# EasyEDA Pro project RV1106_V1.epro, schematic Schematic1

## Sheets
1 POWER: Assembly Variant: Basic; Board Name: Board1; Create Date: 2026-03-10; Page Name: P1; Project Name: rv1106g3-dev-board; Schematic Name: Schematic1; Update Date: 2026-03-10; BladeWidth: 10; Company: 嘉立创EDA; Page Size: A4; RegionStart: 1; ShowBorder: 1; TitleBlock: 1; TitleBlockPosition: 3; Version: V1.0; XRegionCount: 6; YRegionCount: 4
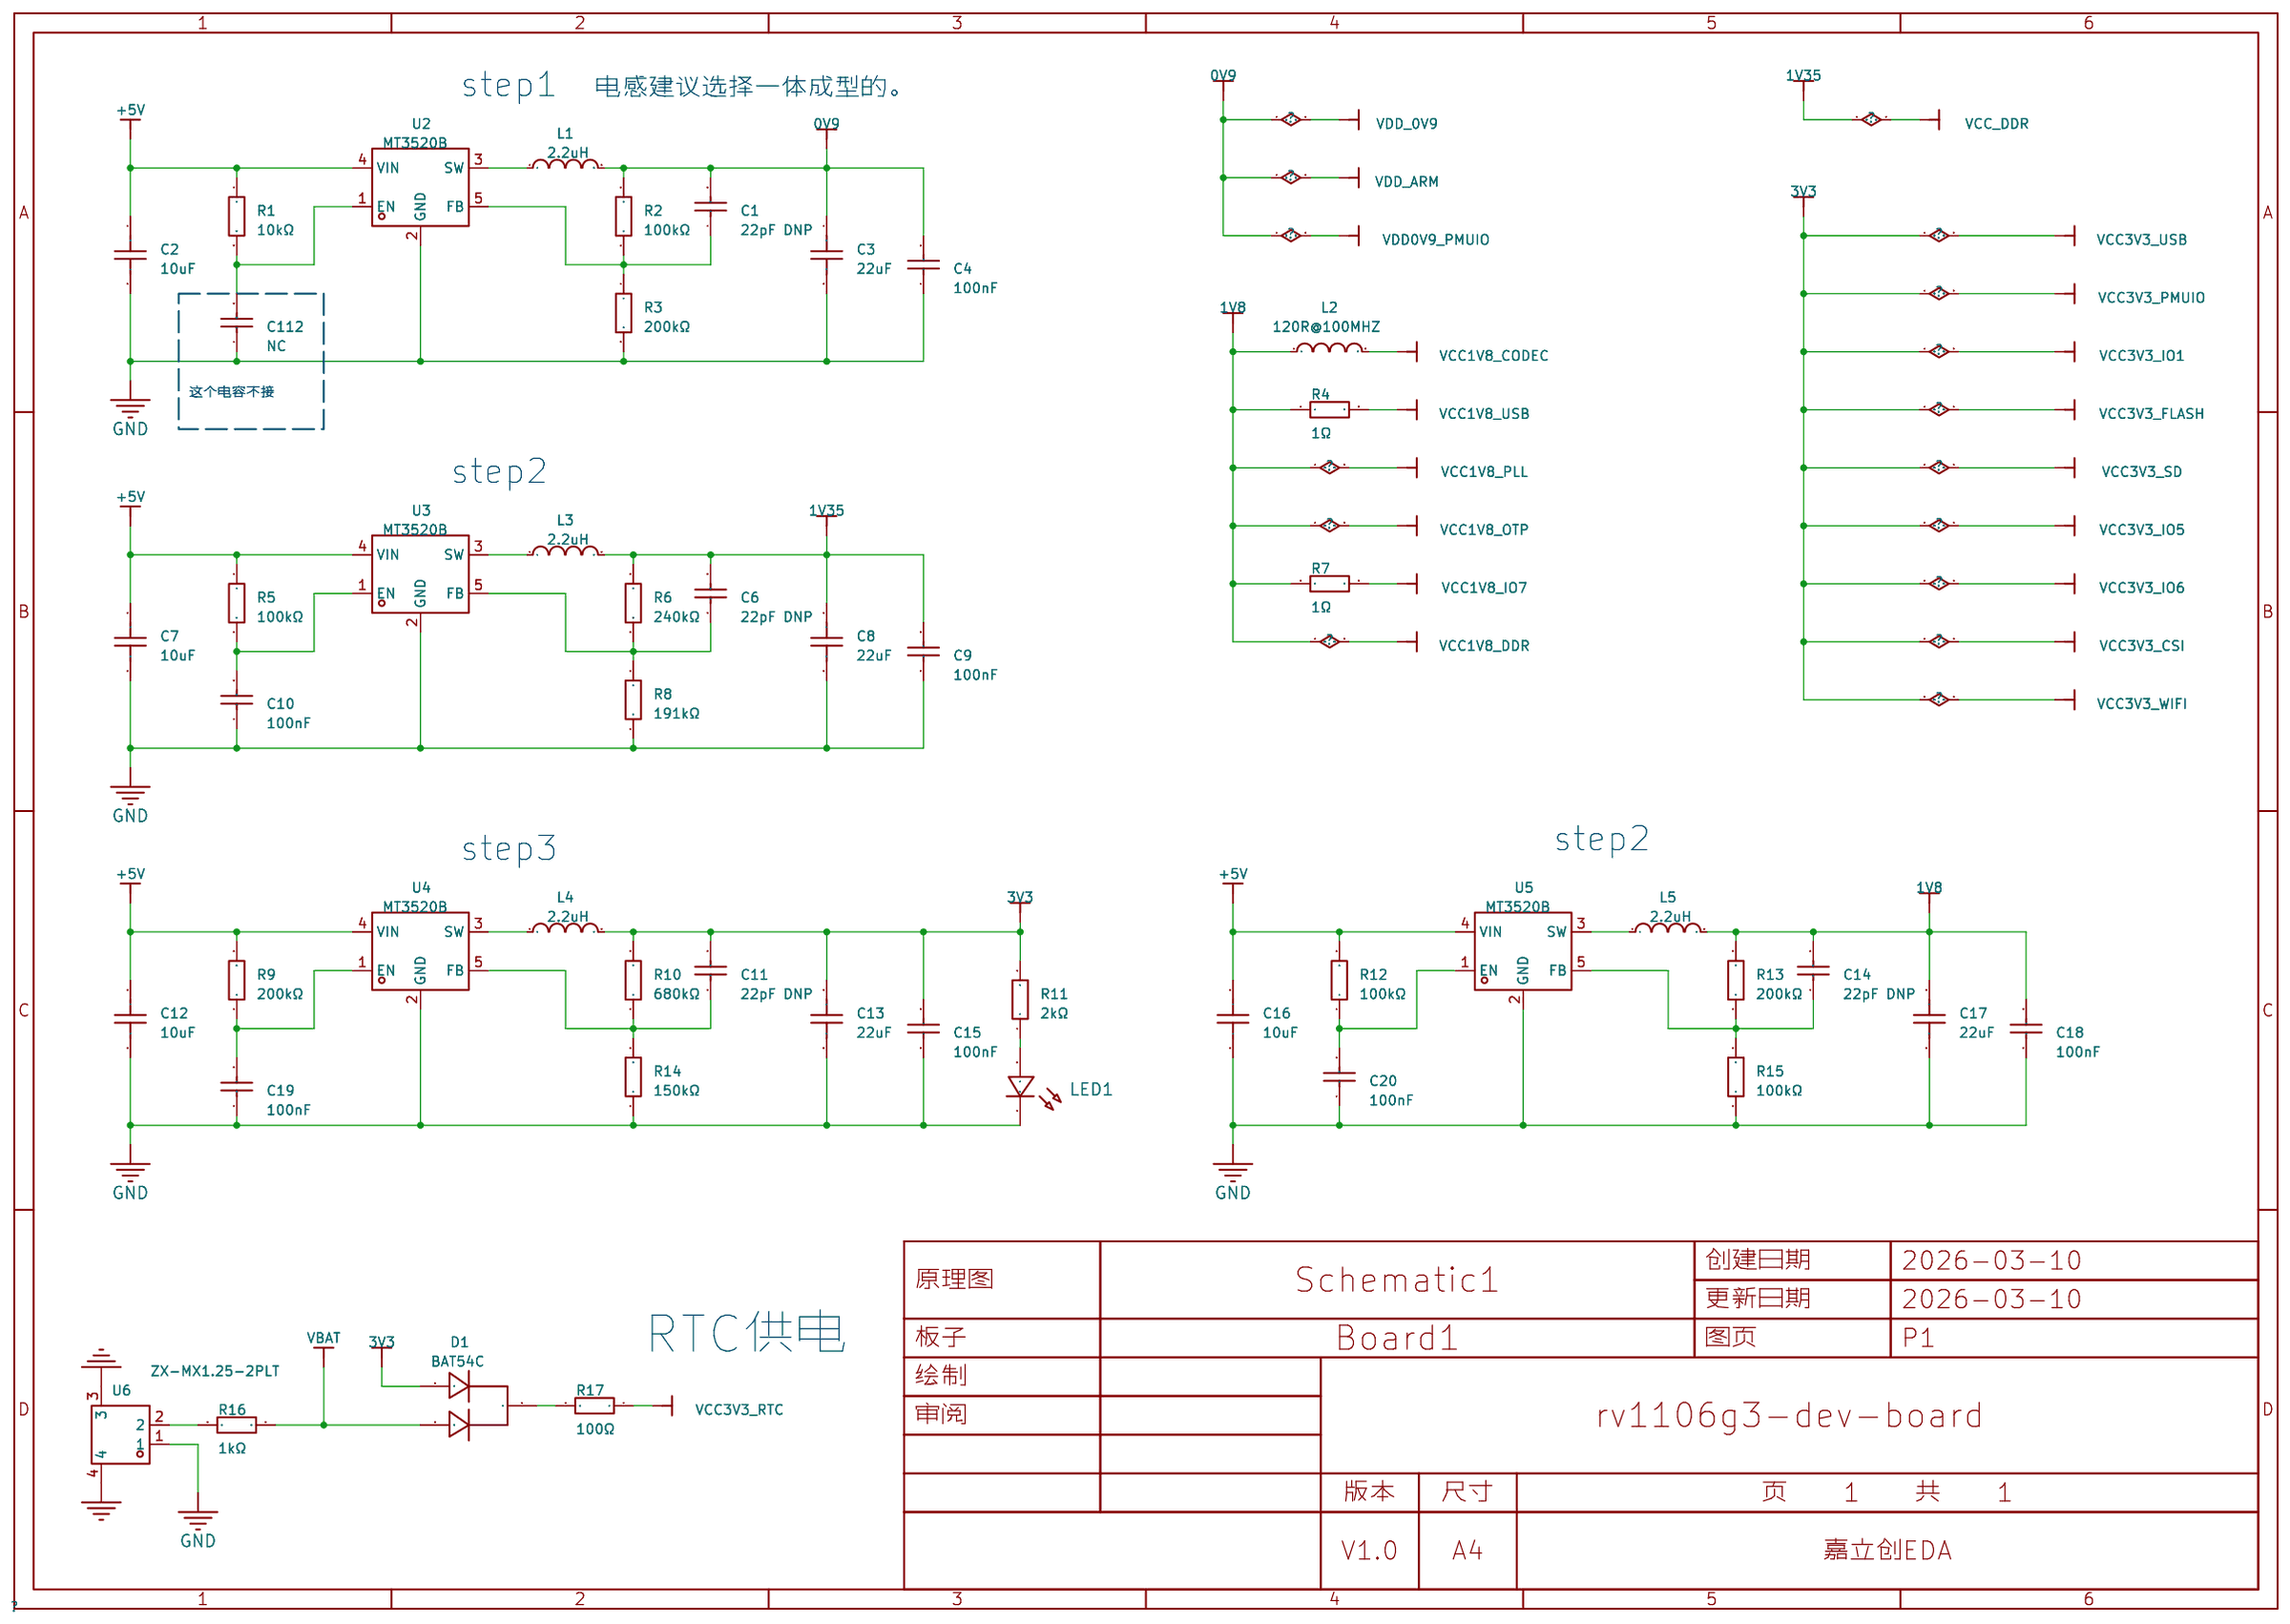
[diagram p0: POWER]
2 PWR_CODEC_ETH_USB: Page Name: P2
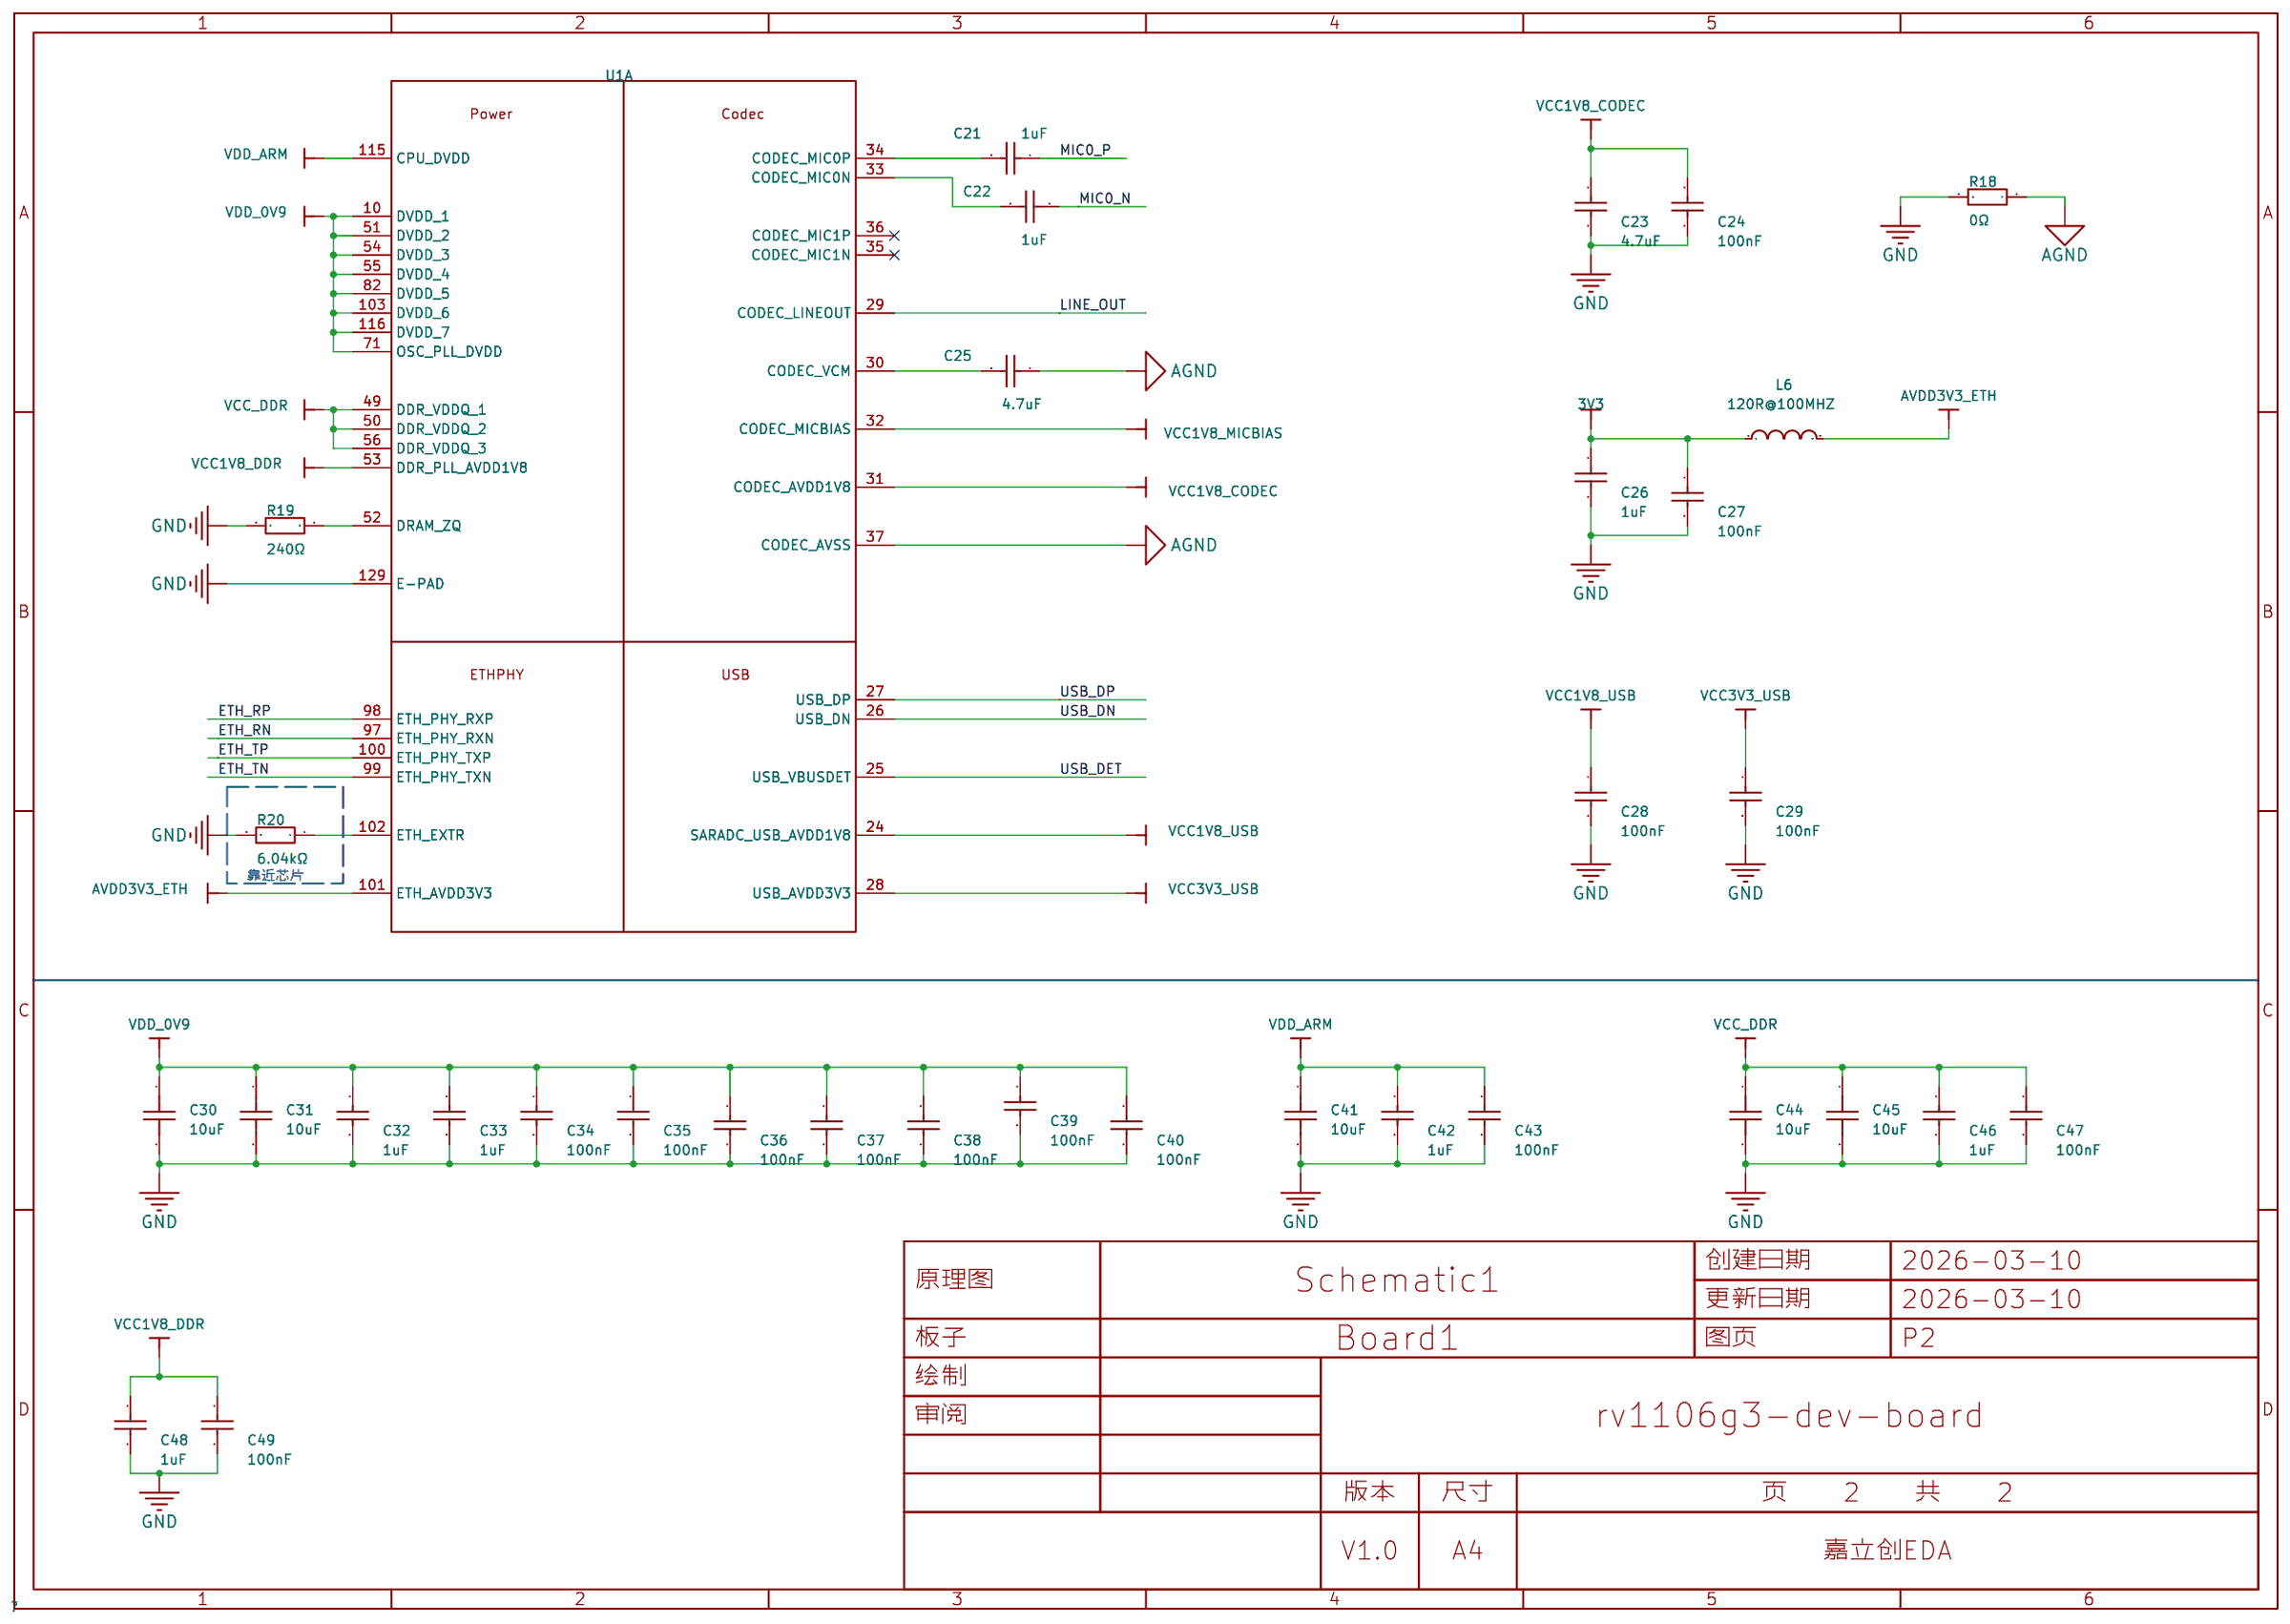
[diagram p1: PWR_CODEC_ETH_USB]
3 OSC_RTC_PMU_IO1
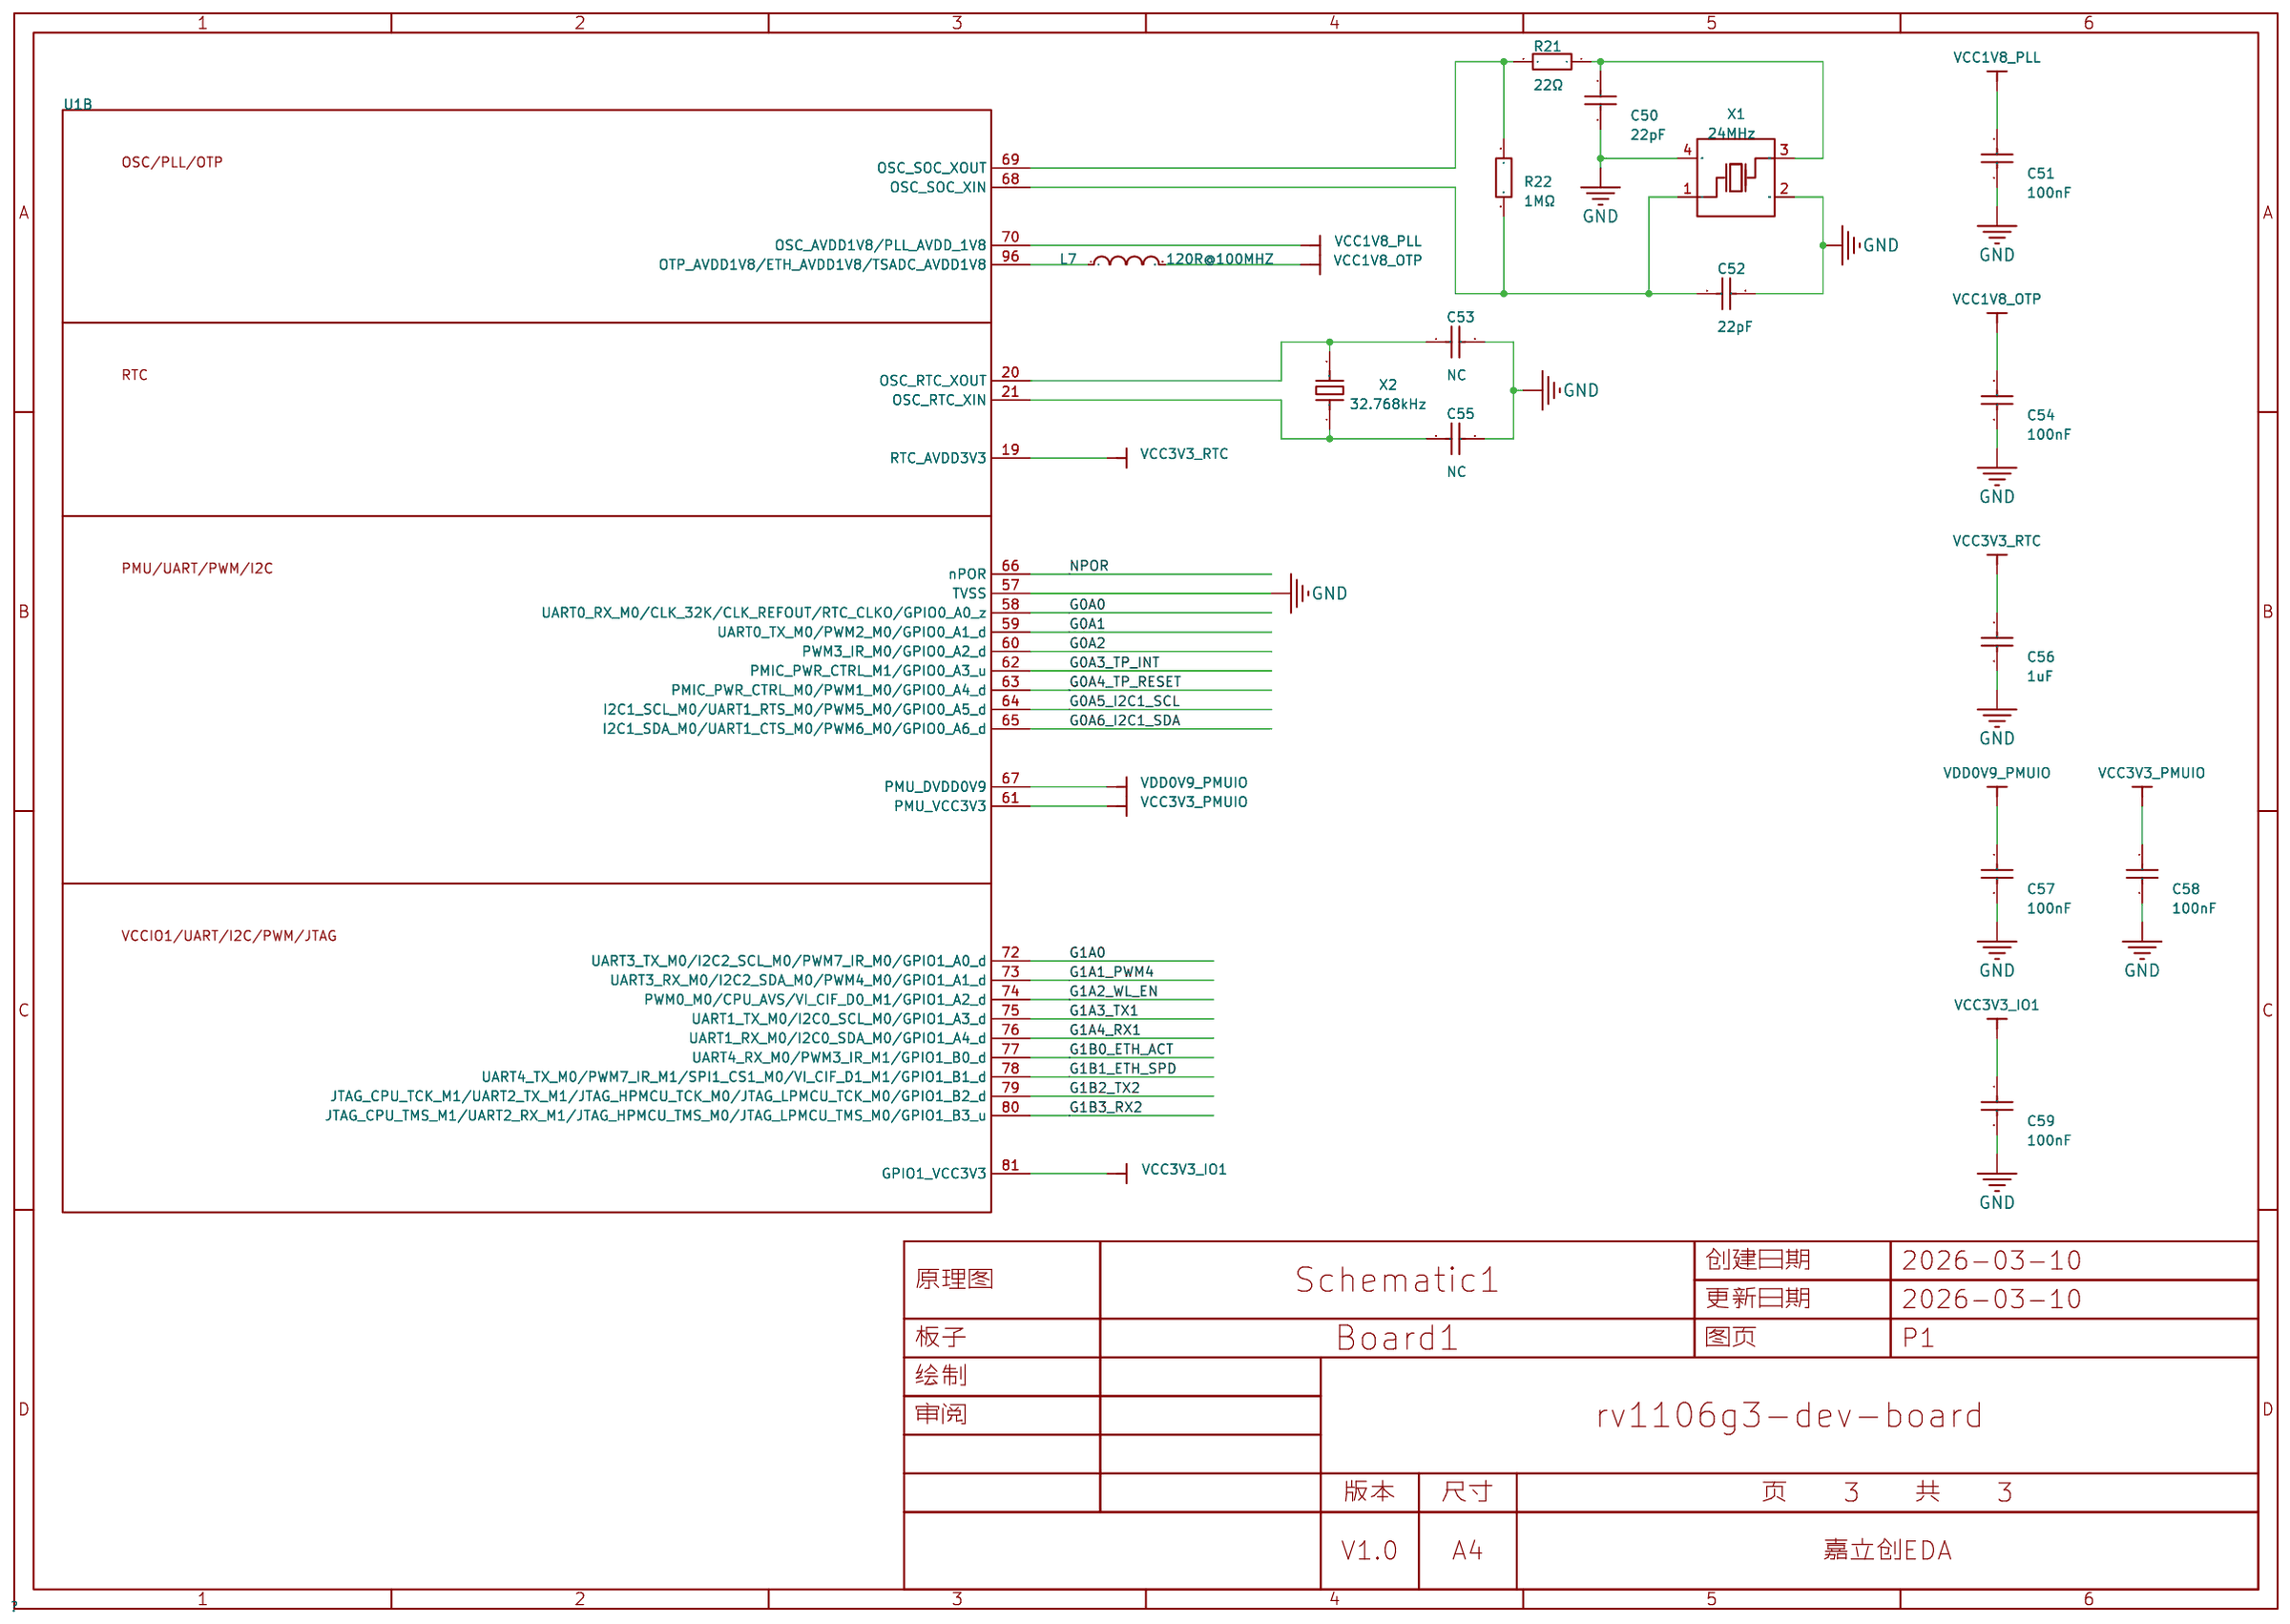
[diagram p2: OSC_RTC_PMU_IO1]
4 ADC_EMMC_SDMMC
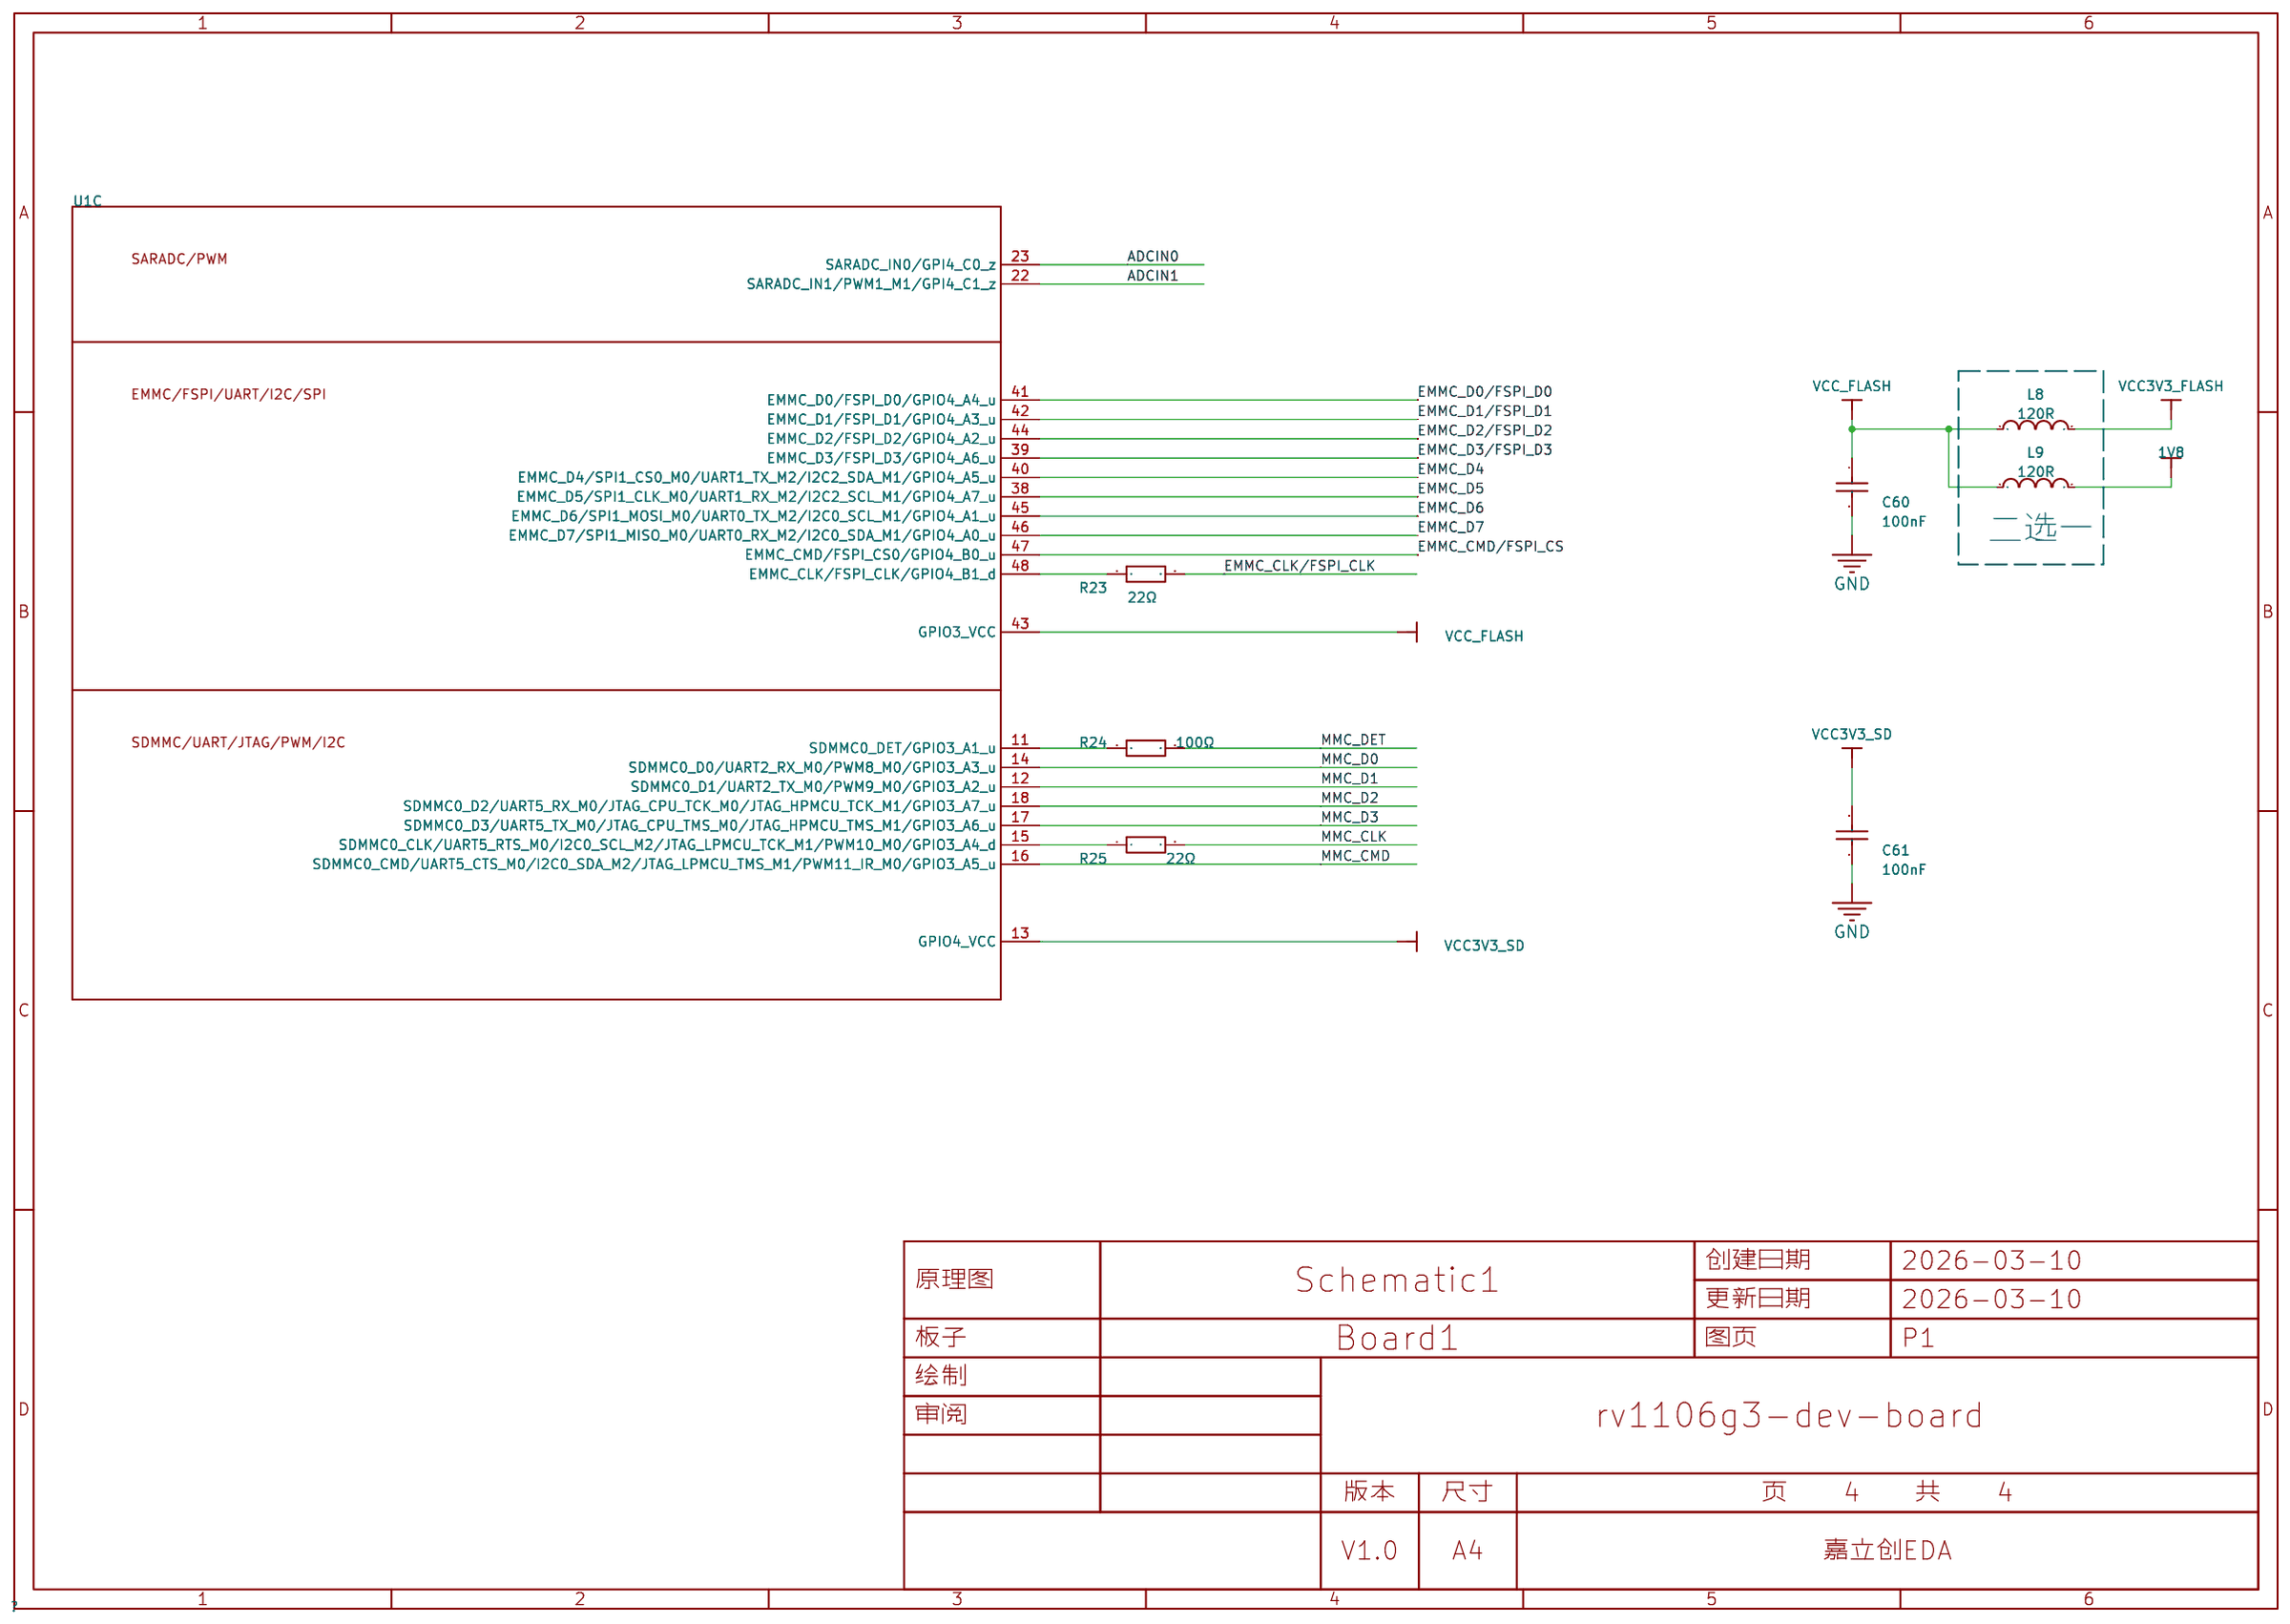
[diagram p3: ADC_EMMC_SDMMC]
5 RGB_MIPI
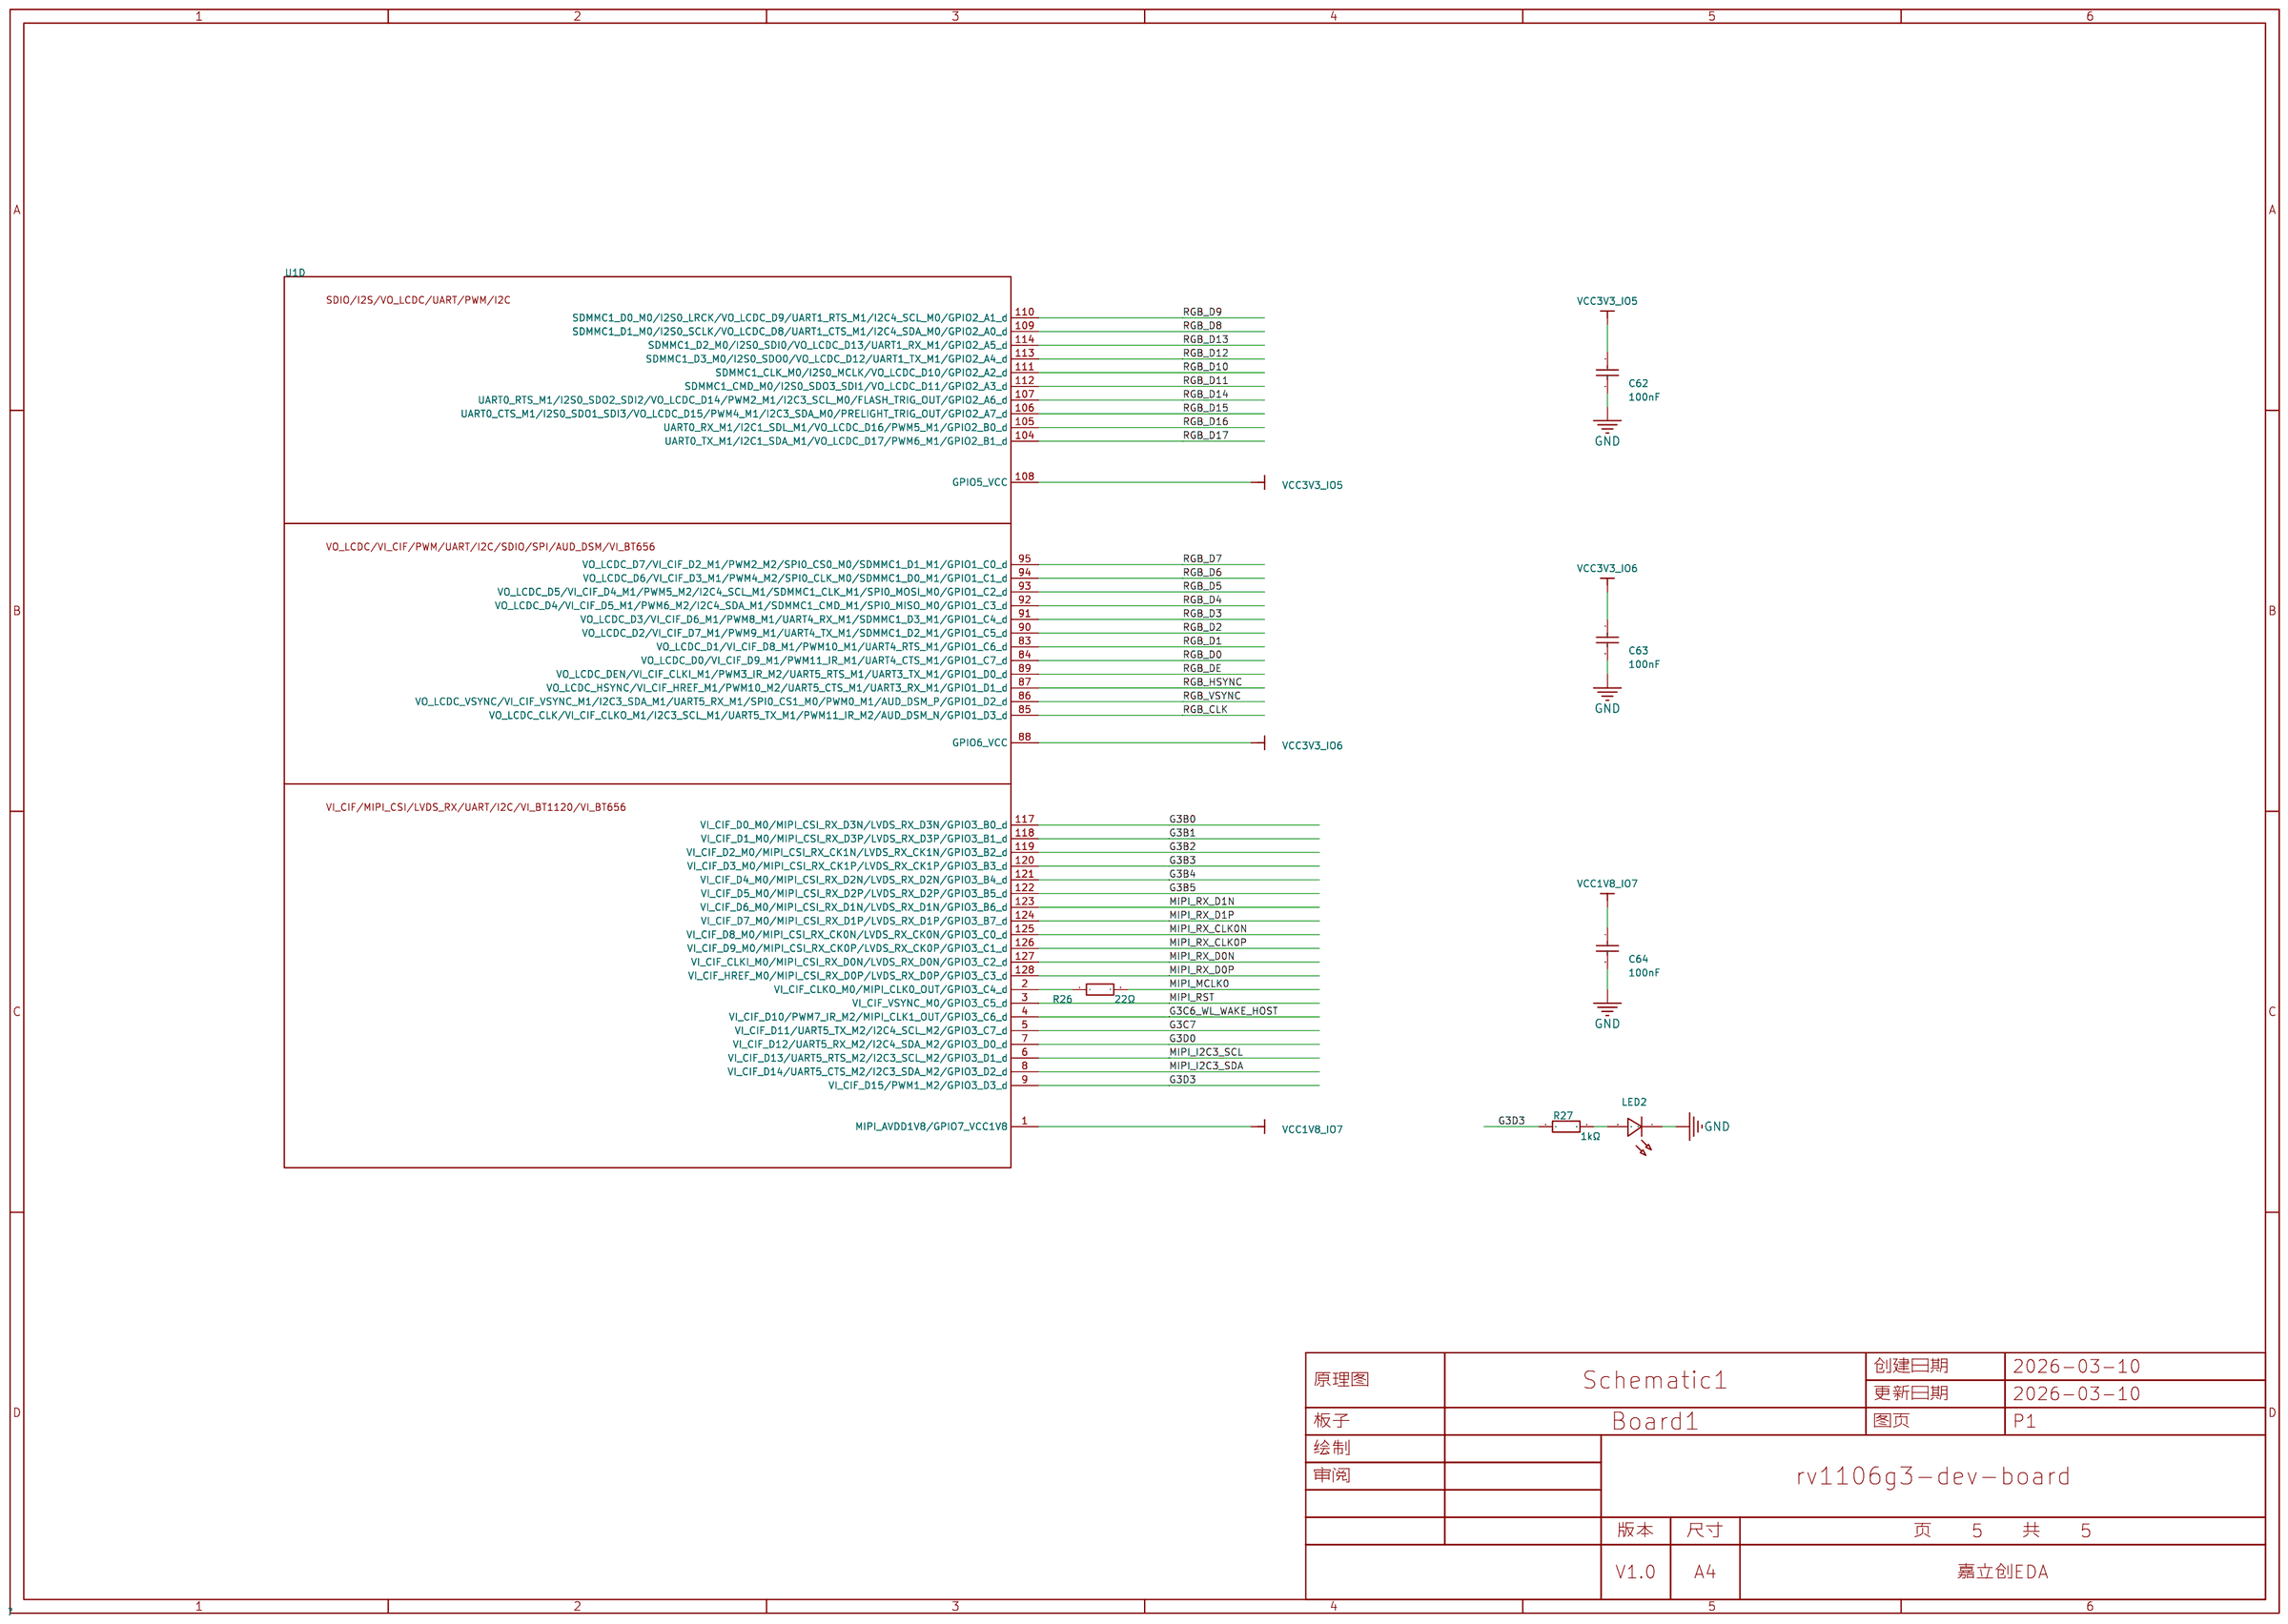
[diagram p4: RGB_MIPI]
6 AUDIO
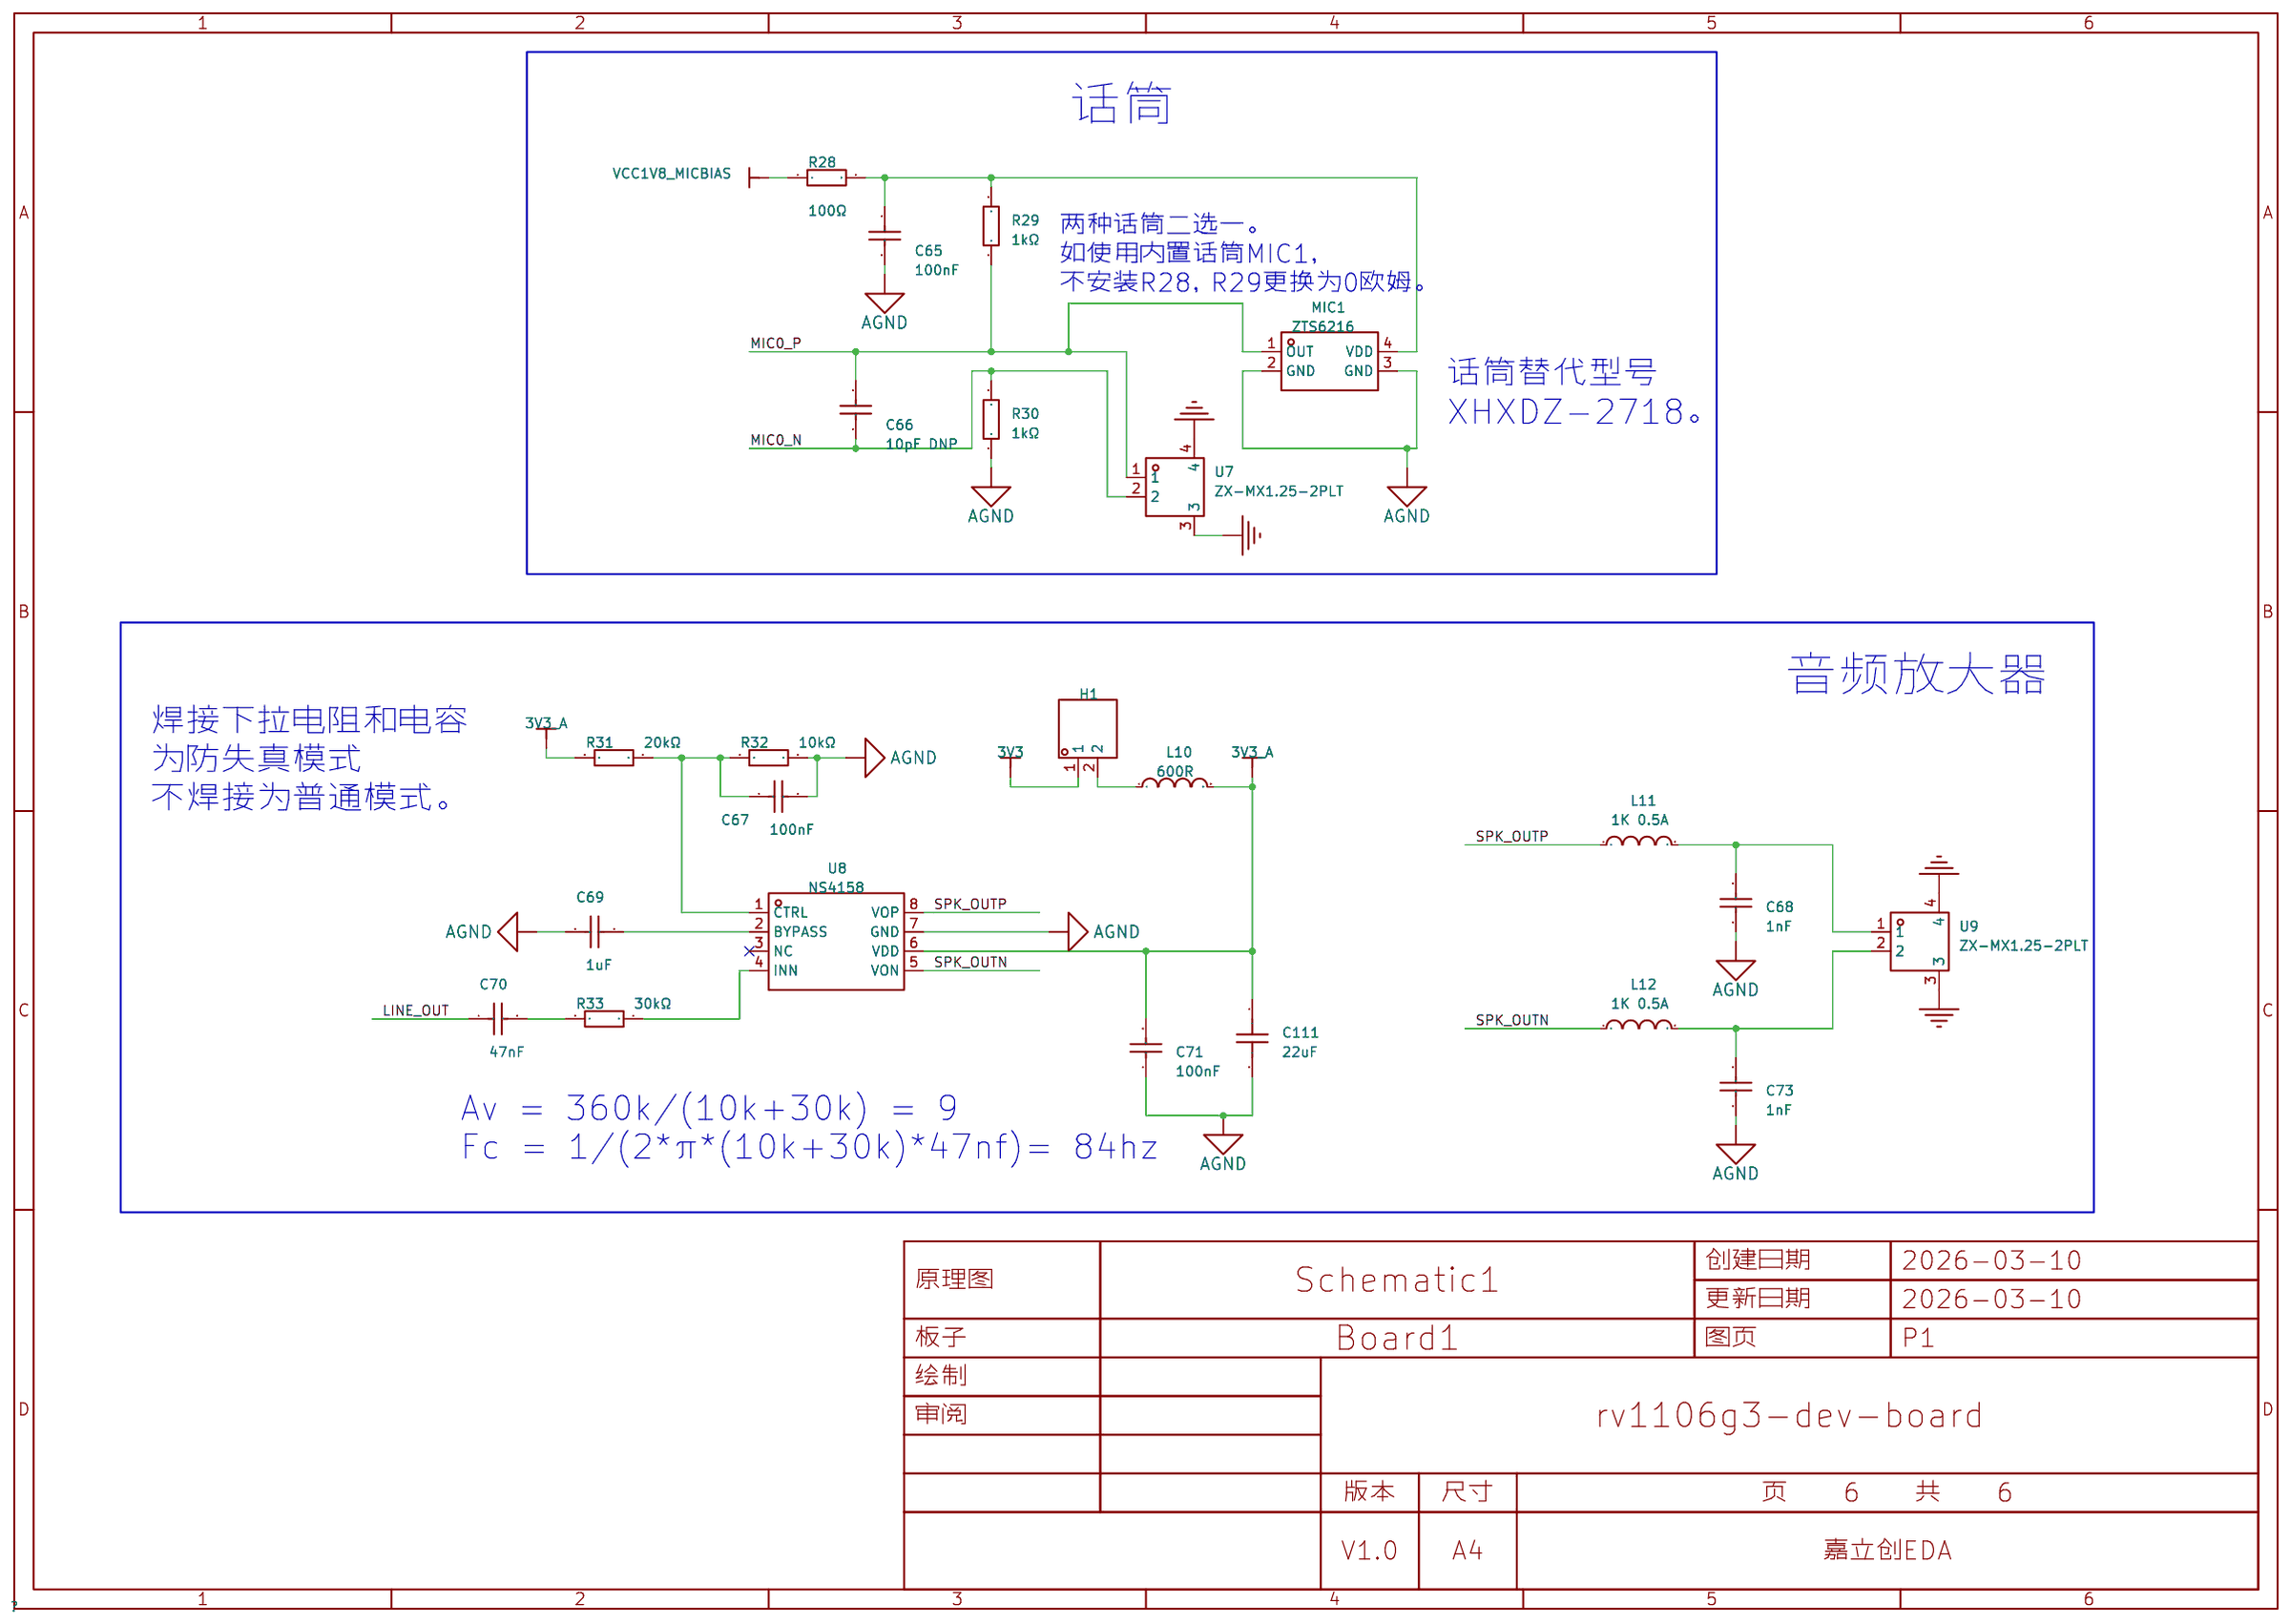
[diagram p5: AUDIO]
7 ETHERNET_KEY
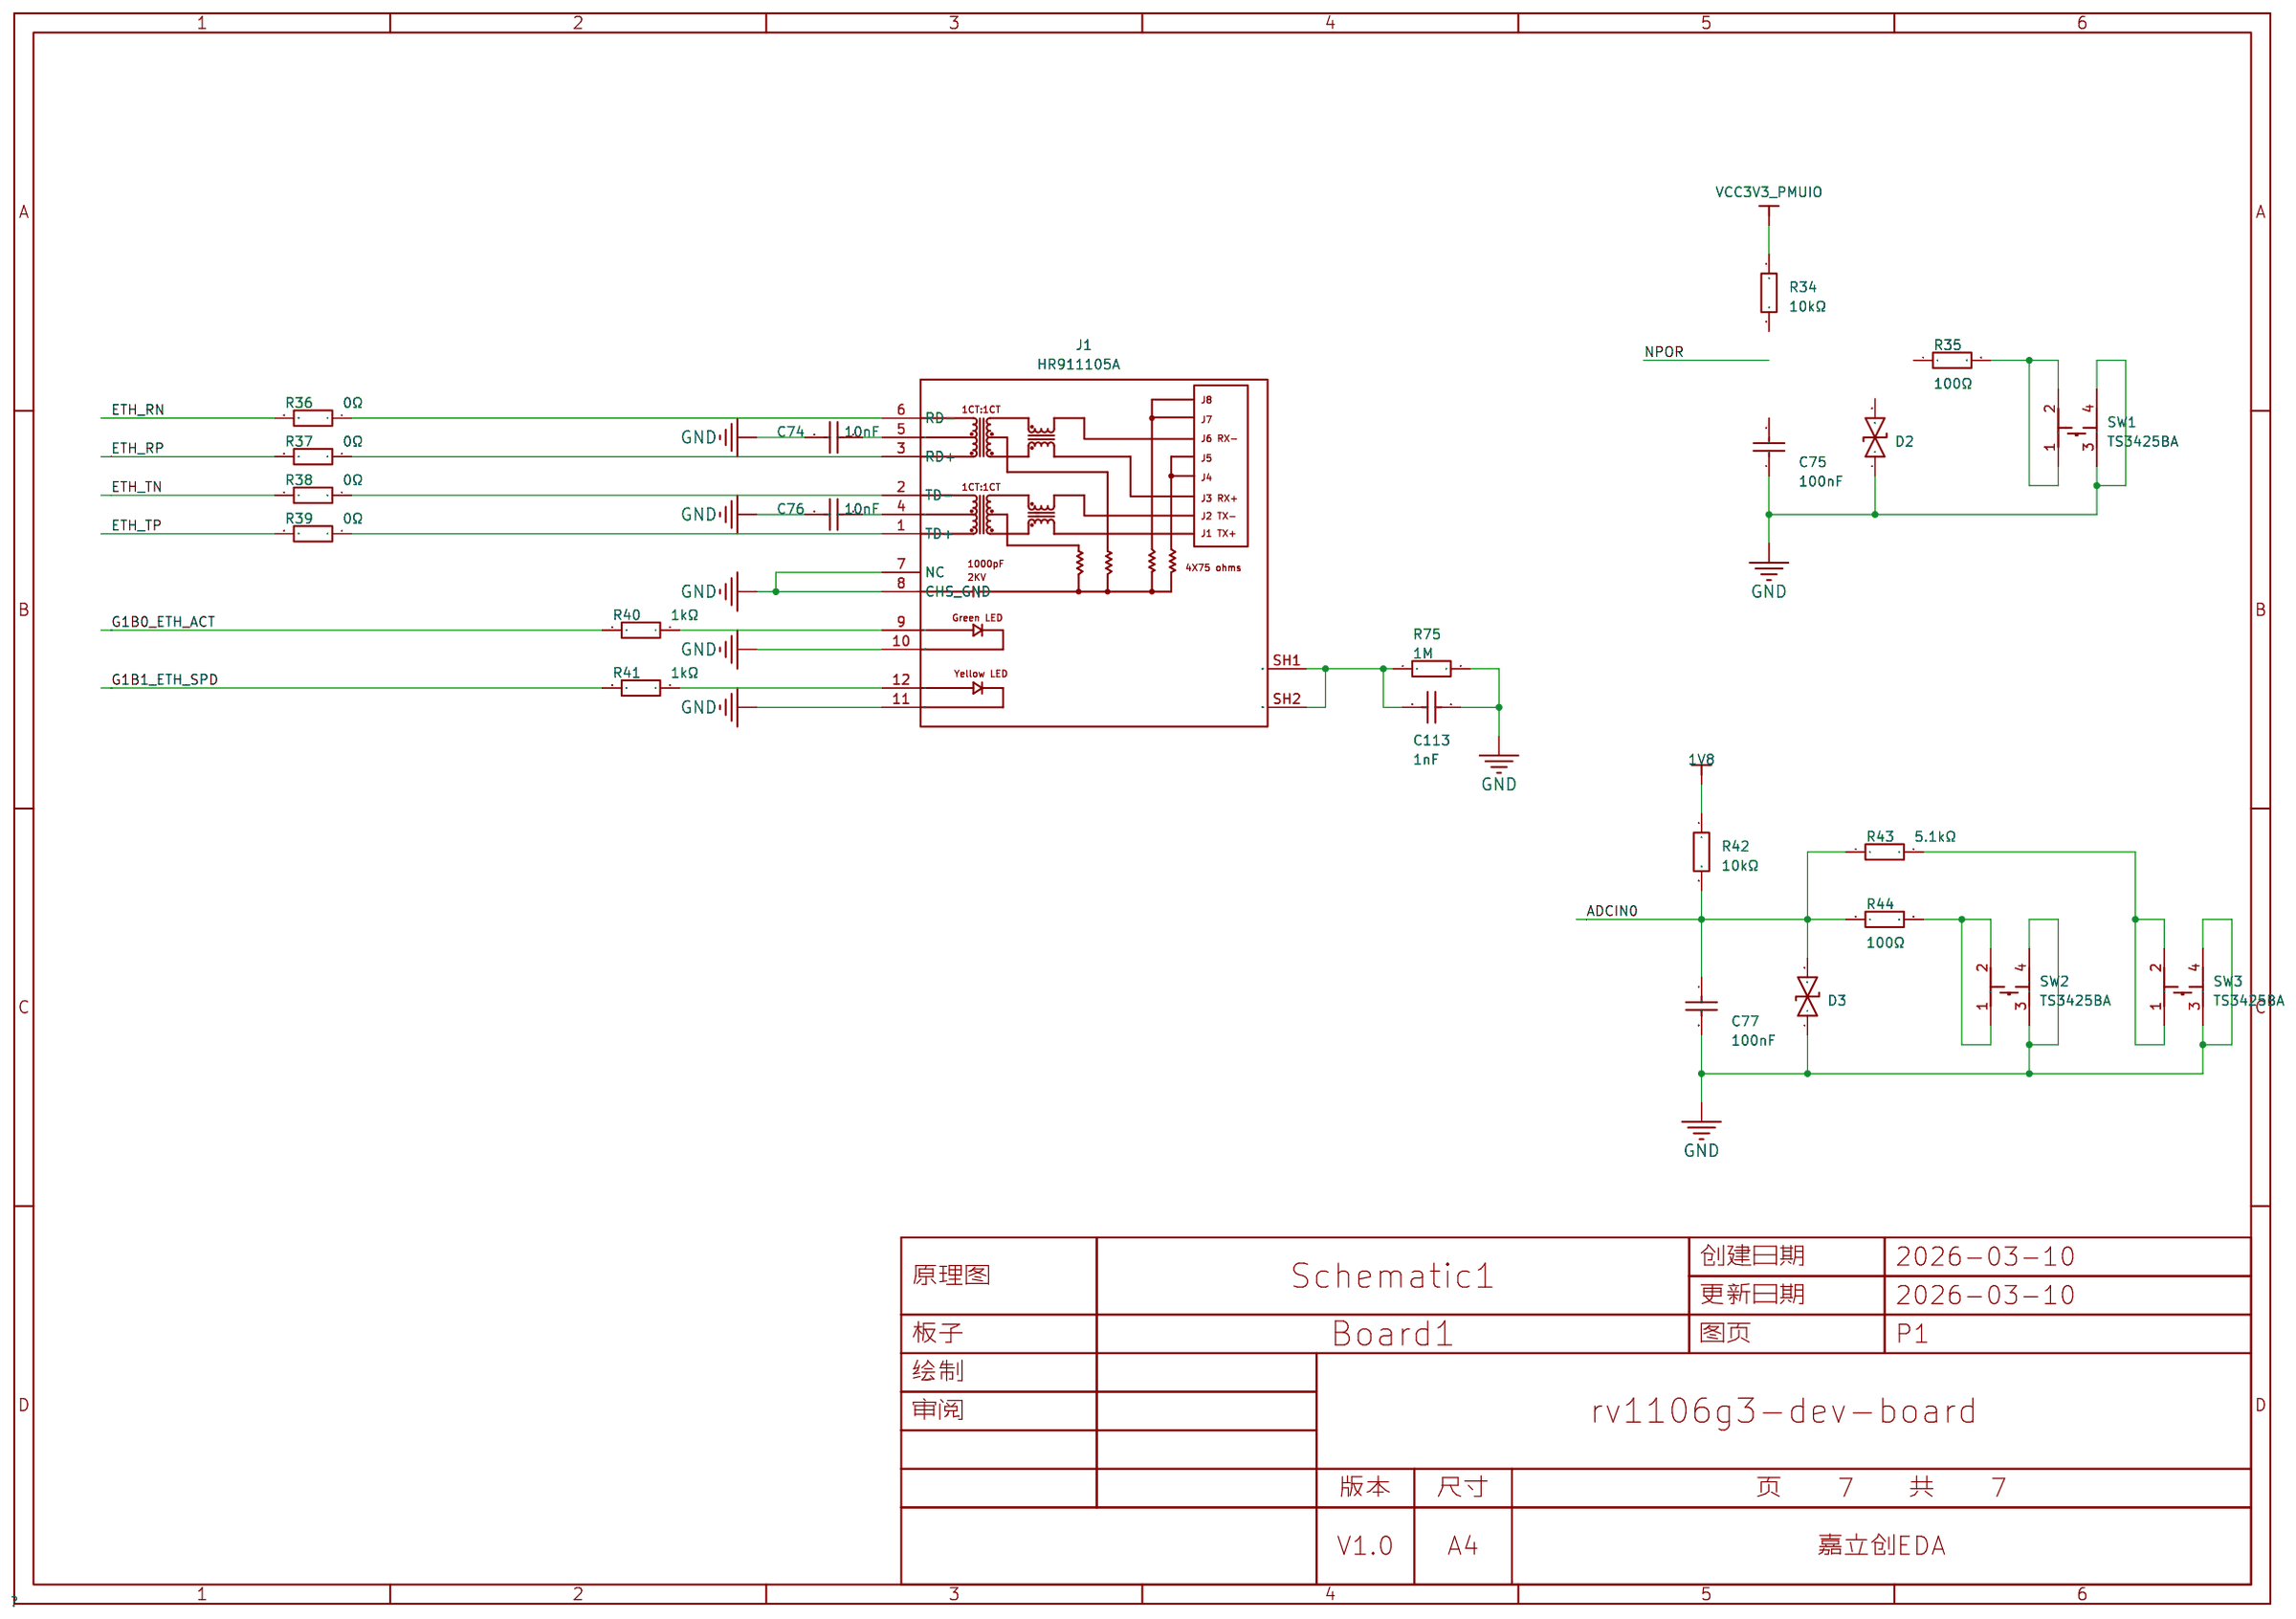
[diagram p6: ETHERNET_KEY]
8 USB_GPIO
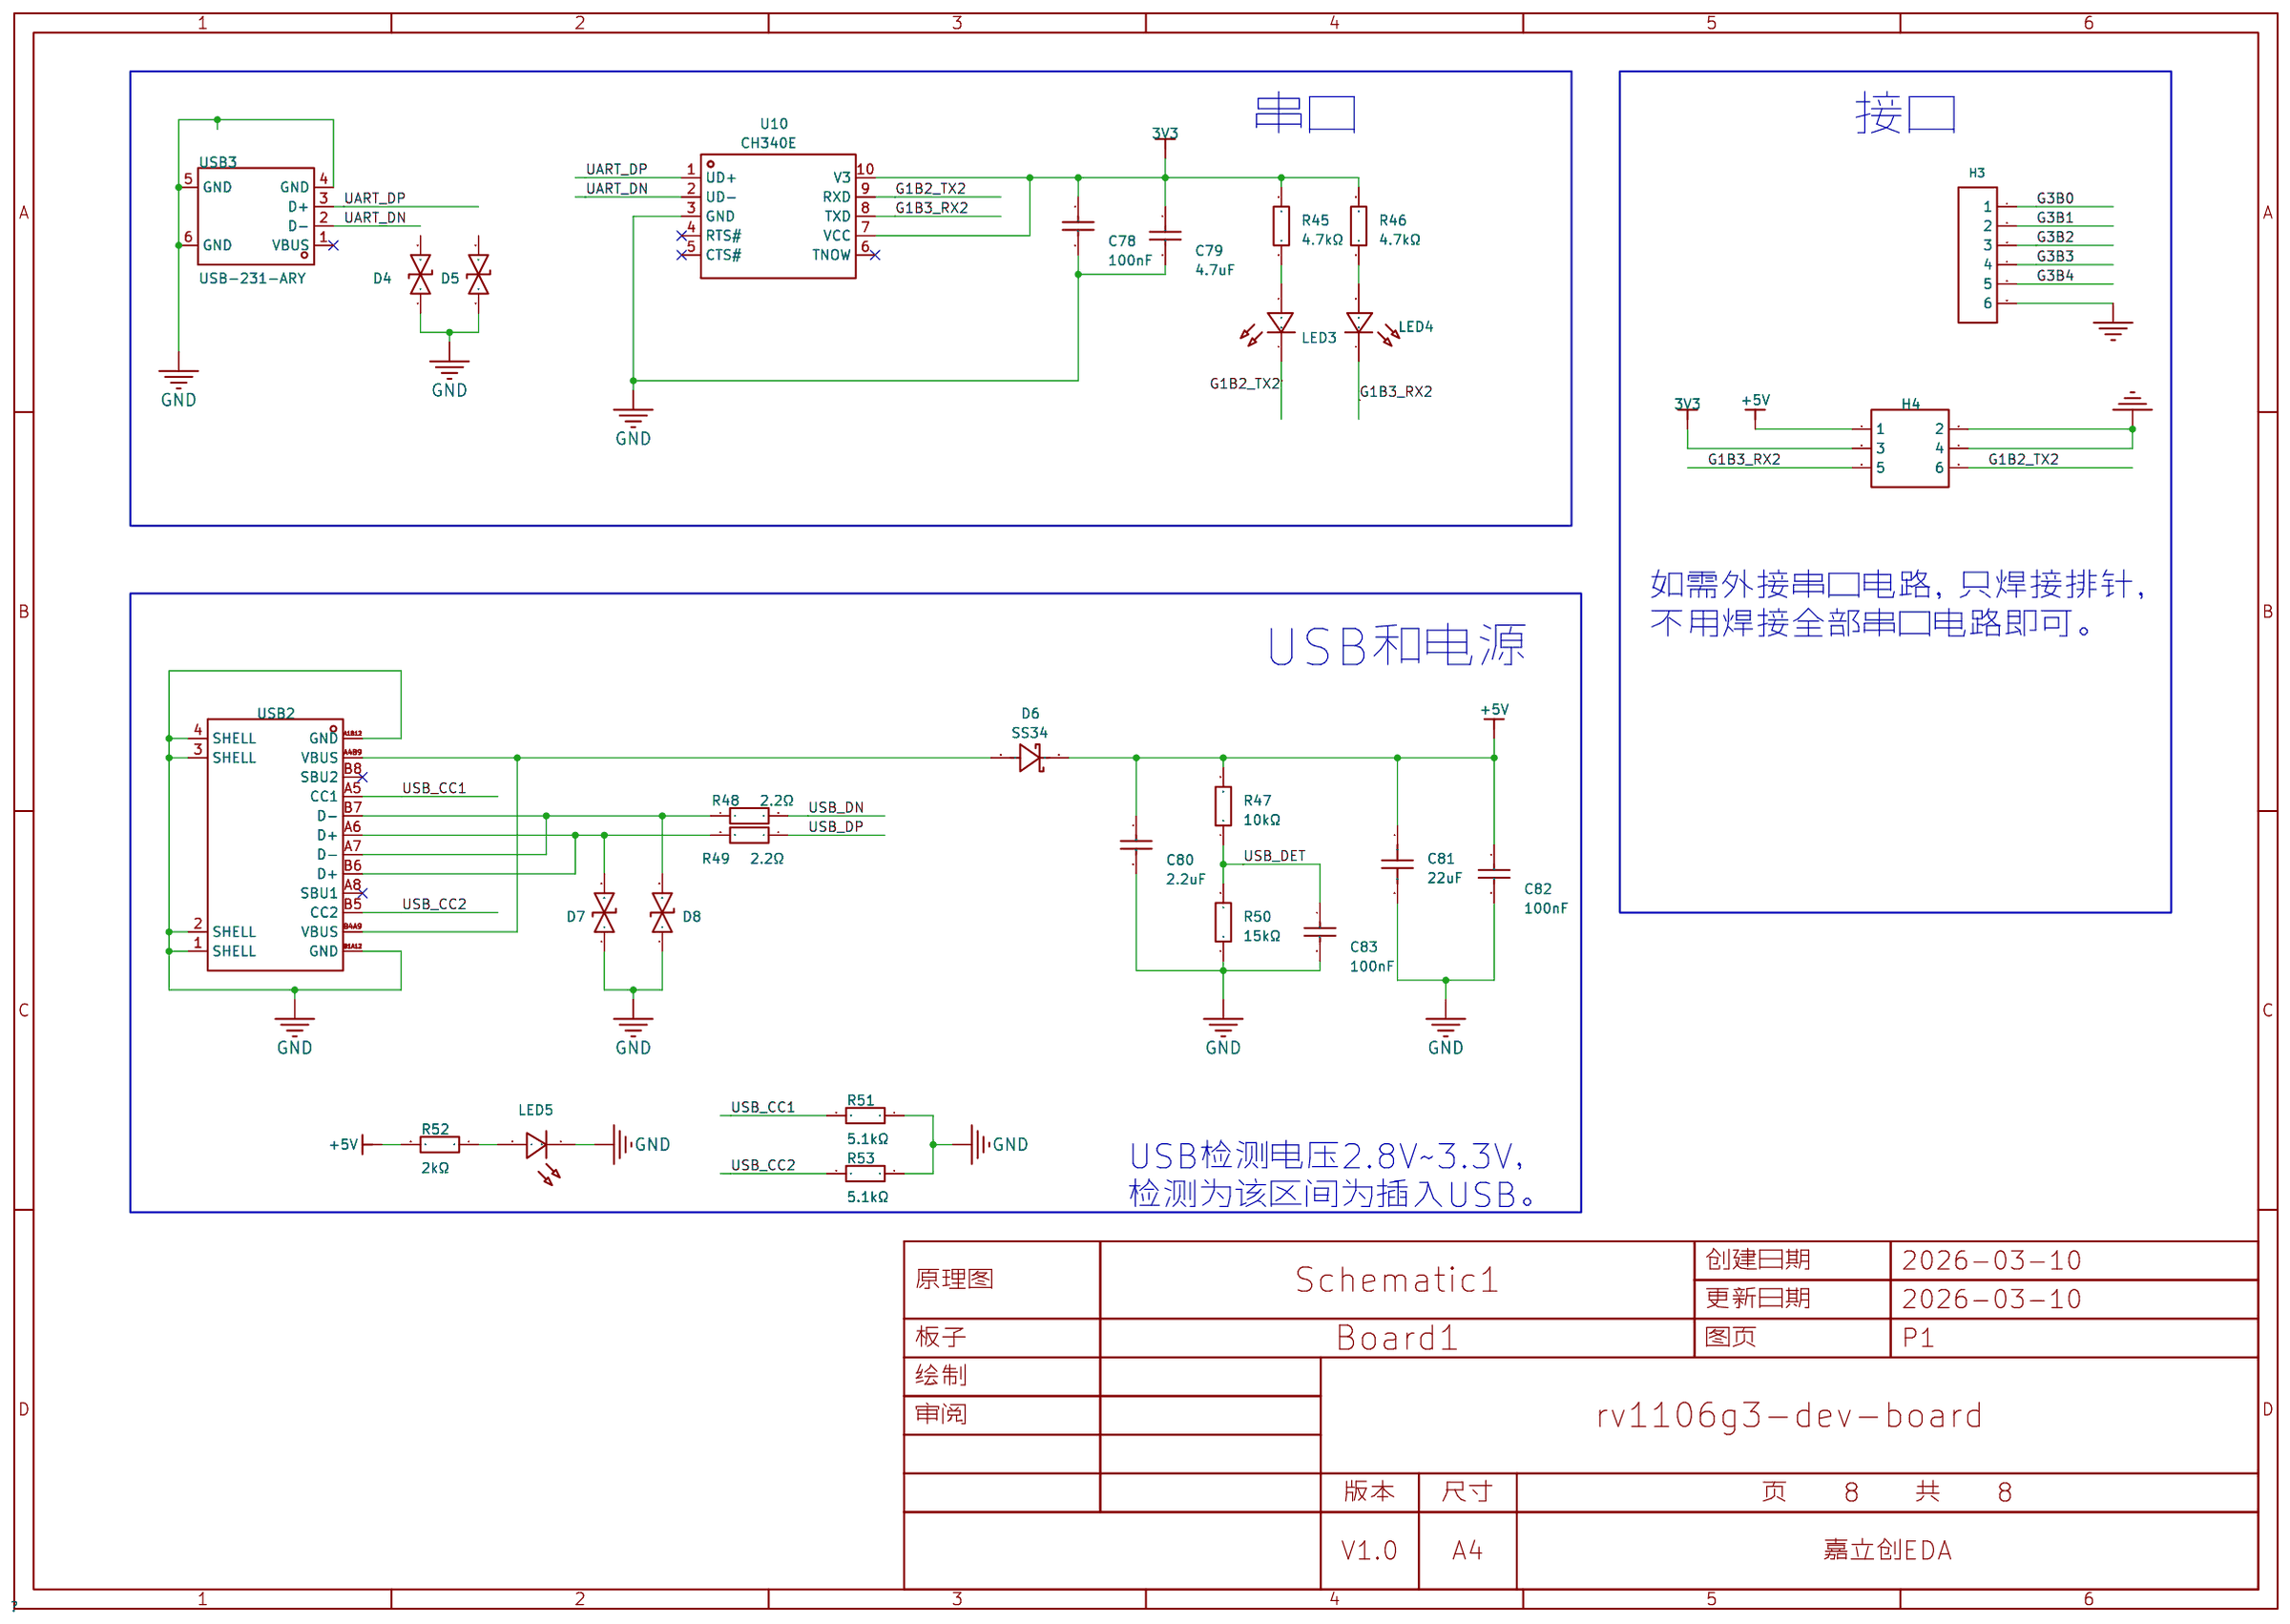
[diagram p7: USB_GPIO]
9 FLASH_EMMC
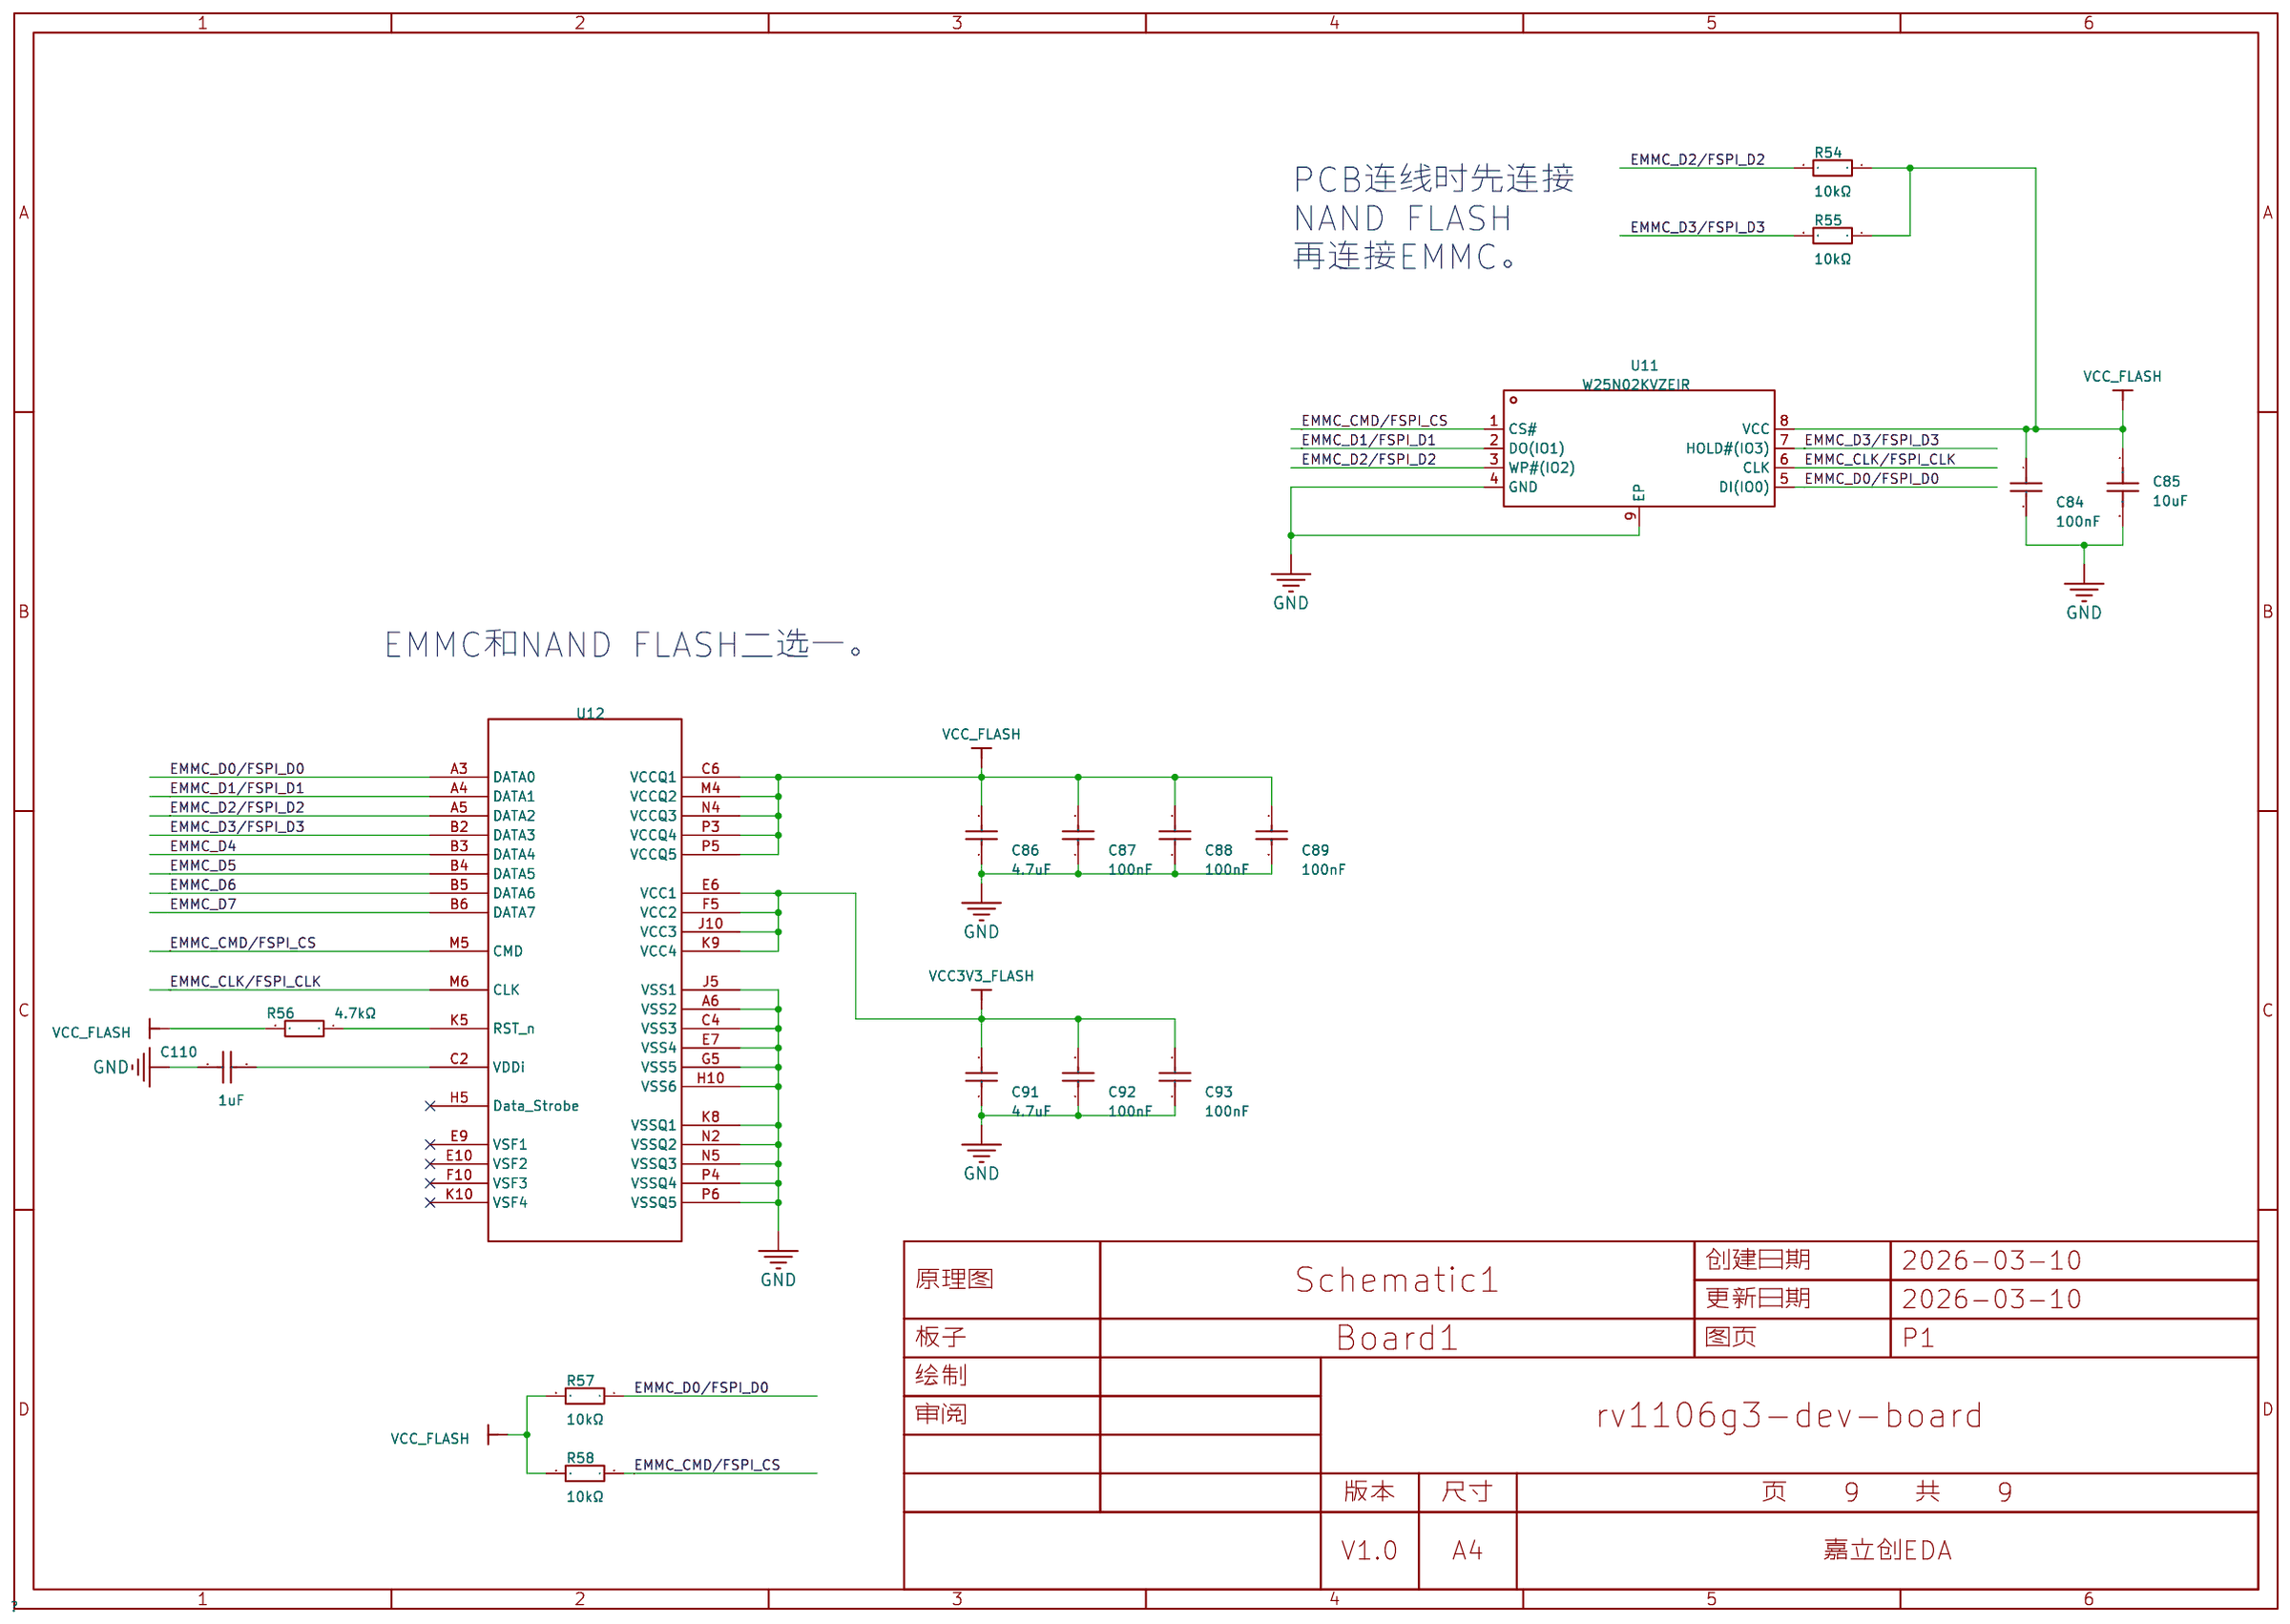
[diagram p8: FLASH_EMMC]
10 TF-Card
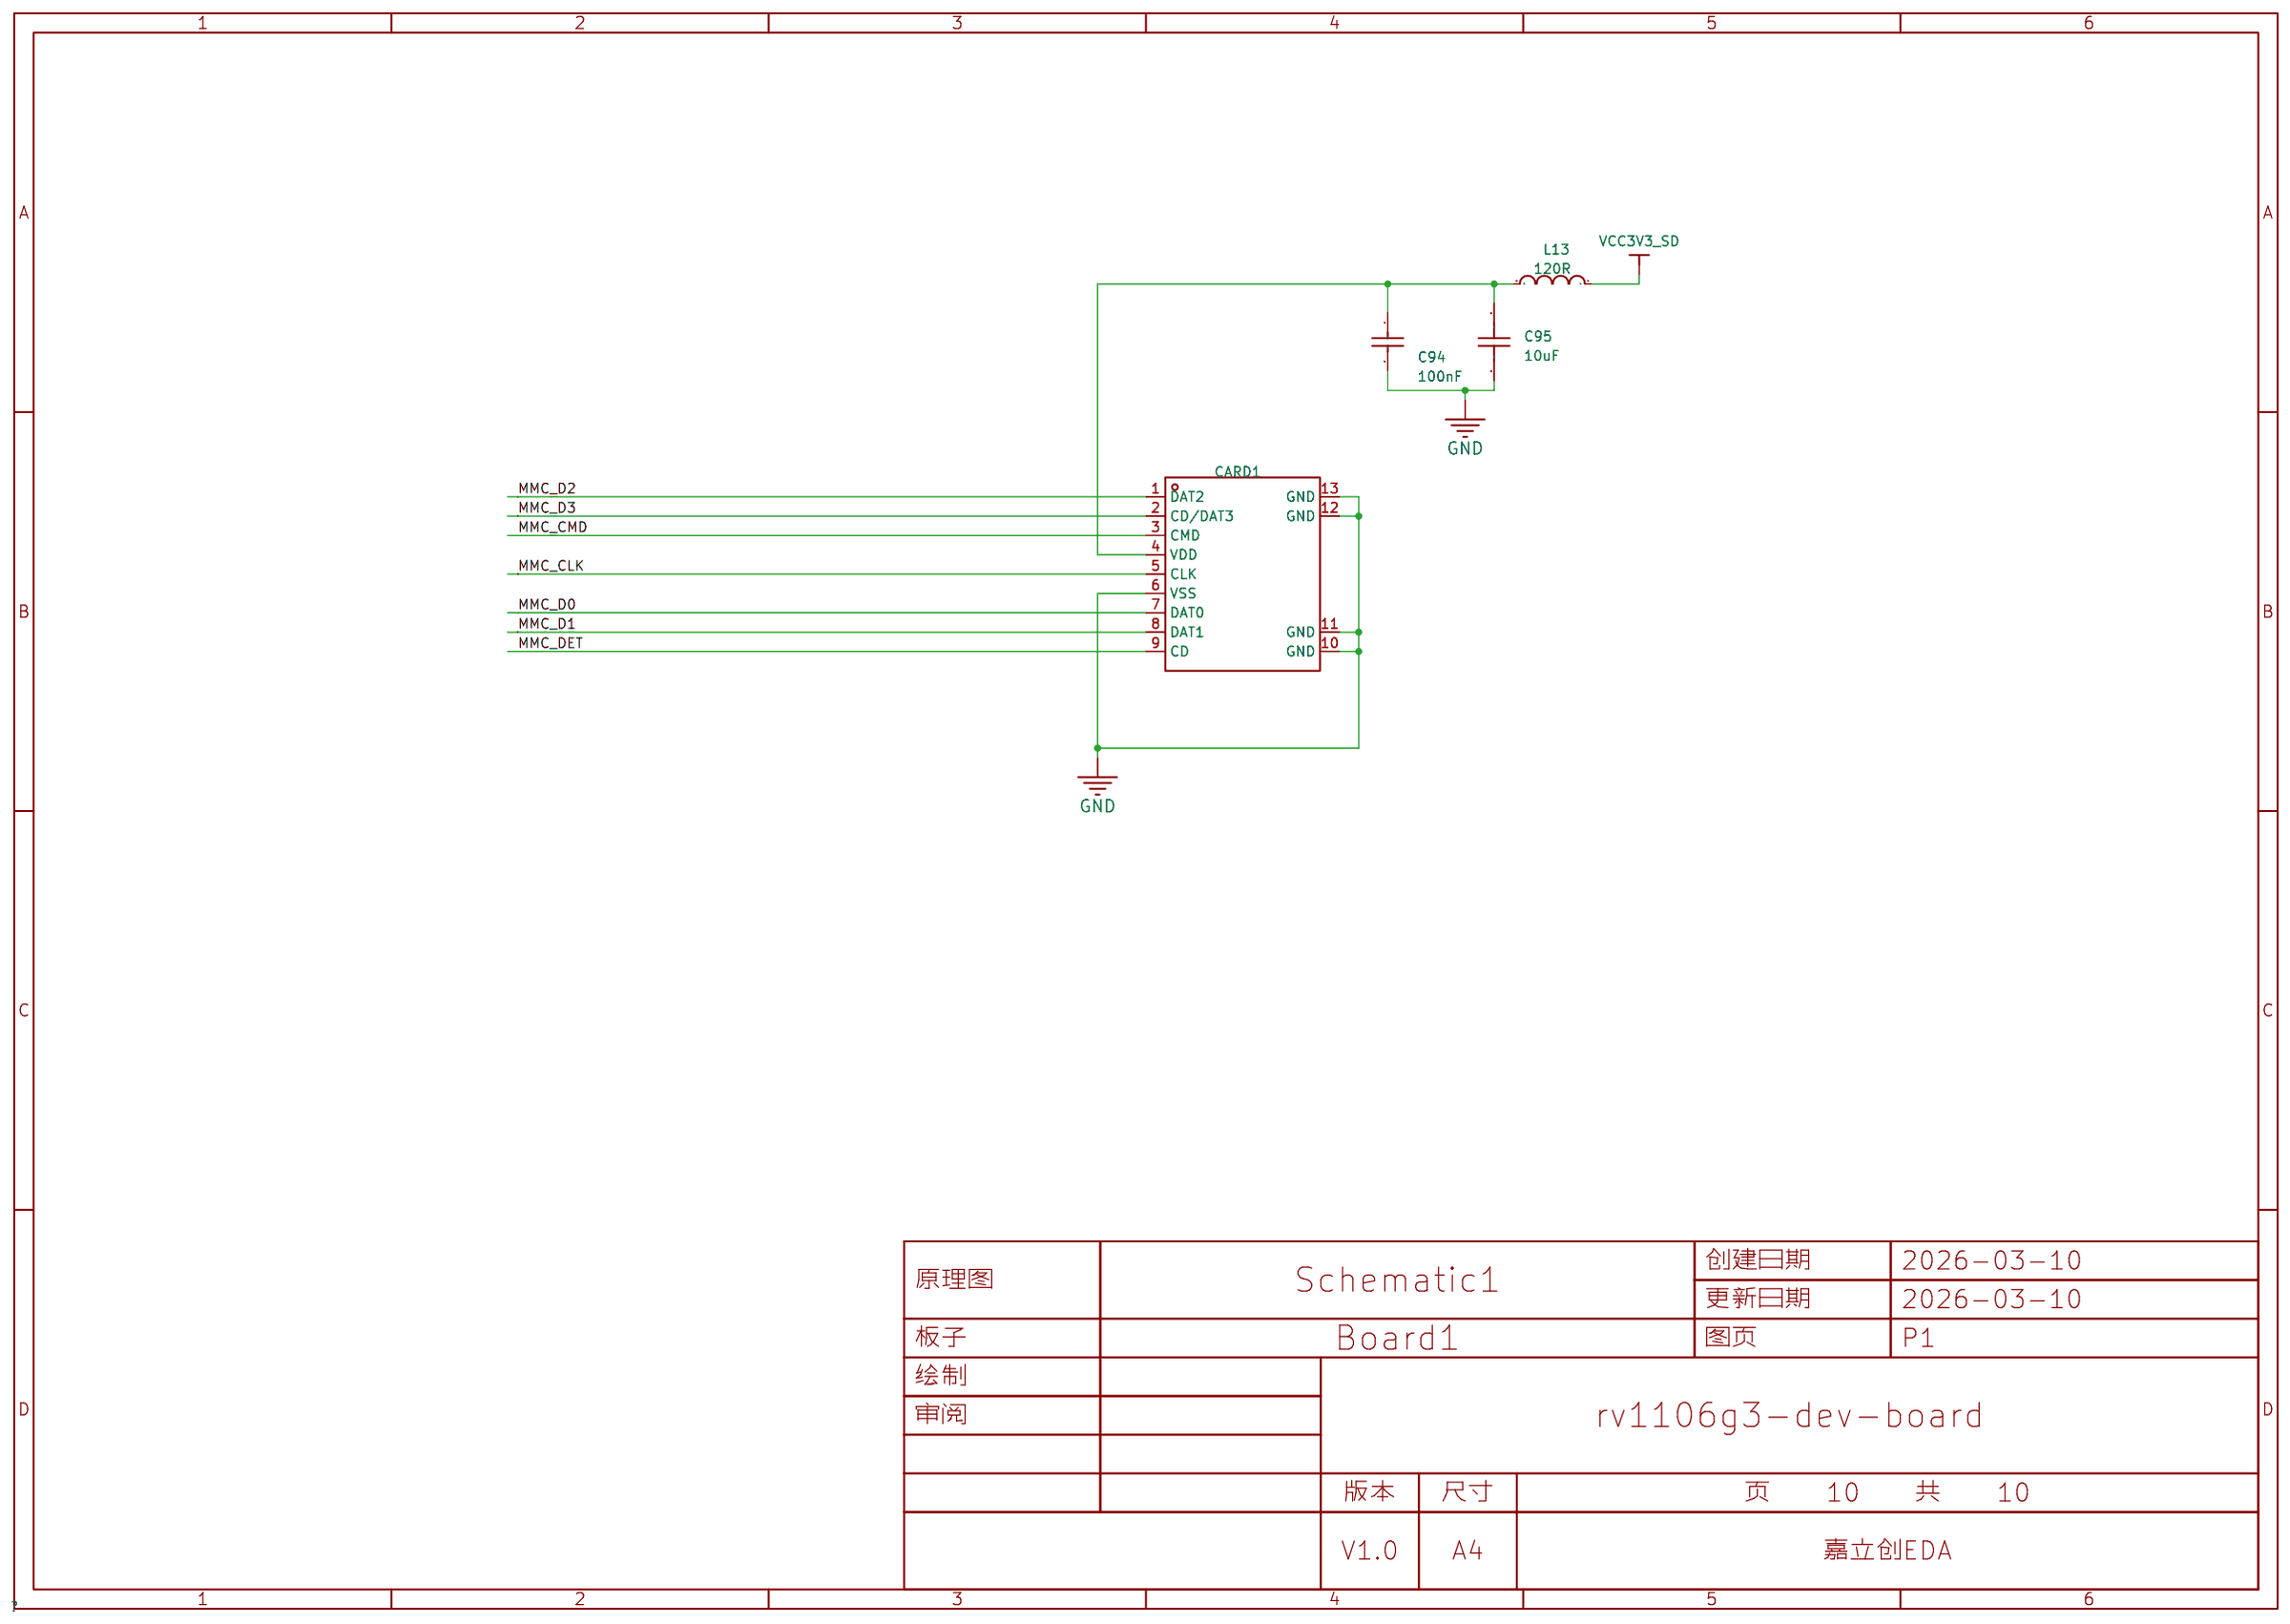
[diagram p9: TF-Card]
11 LCD
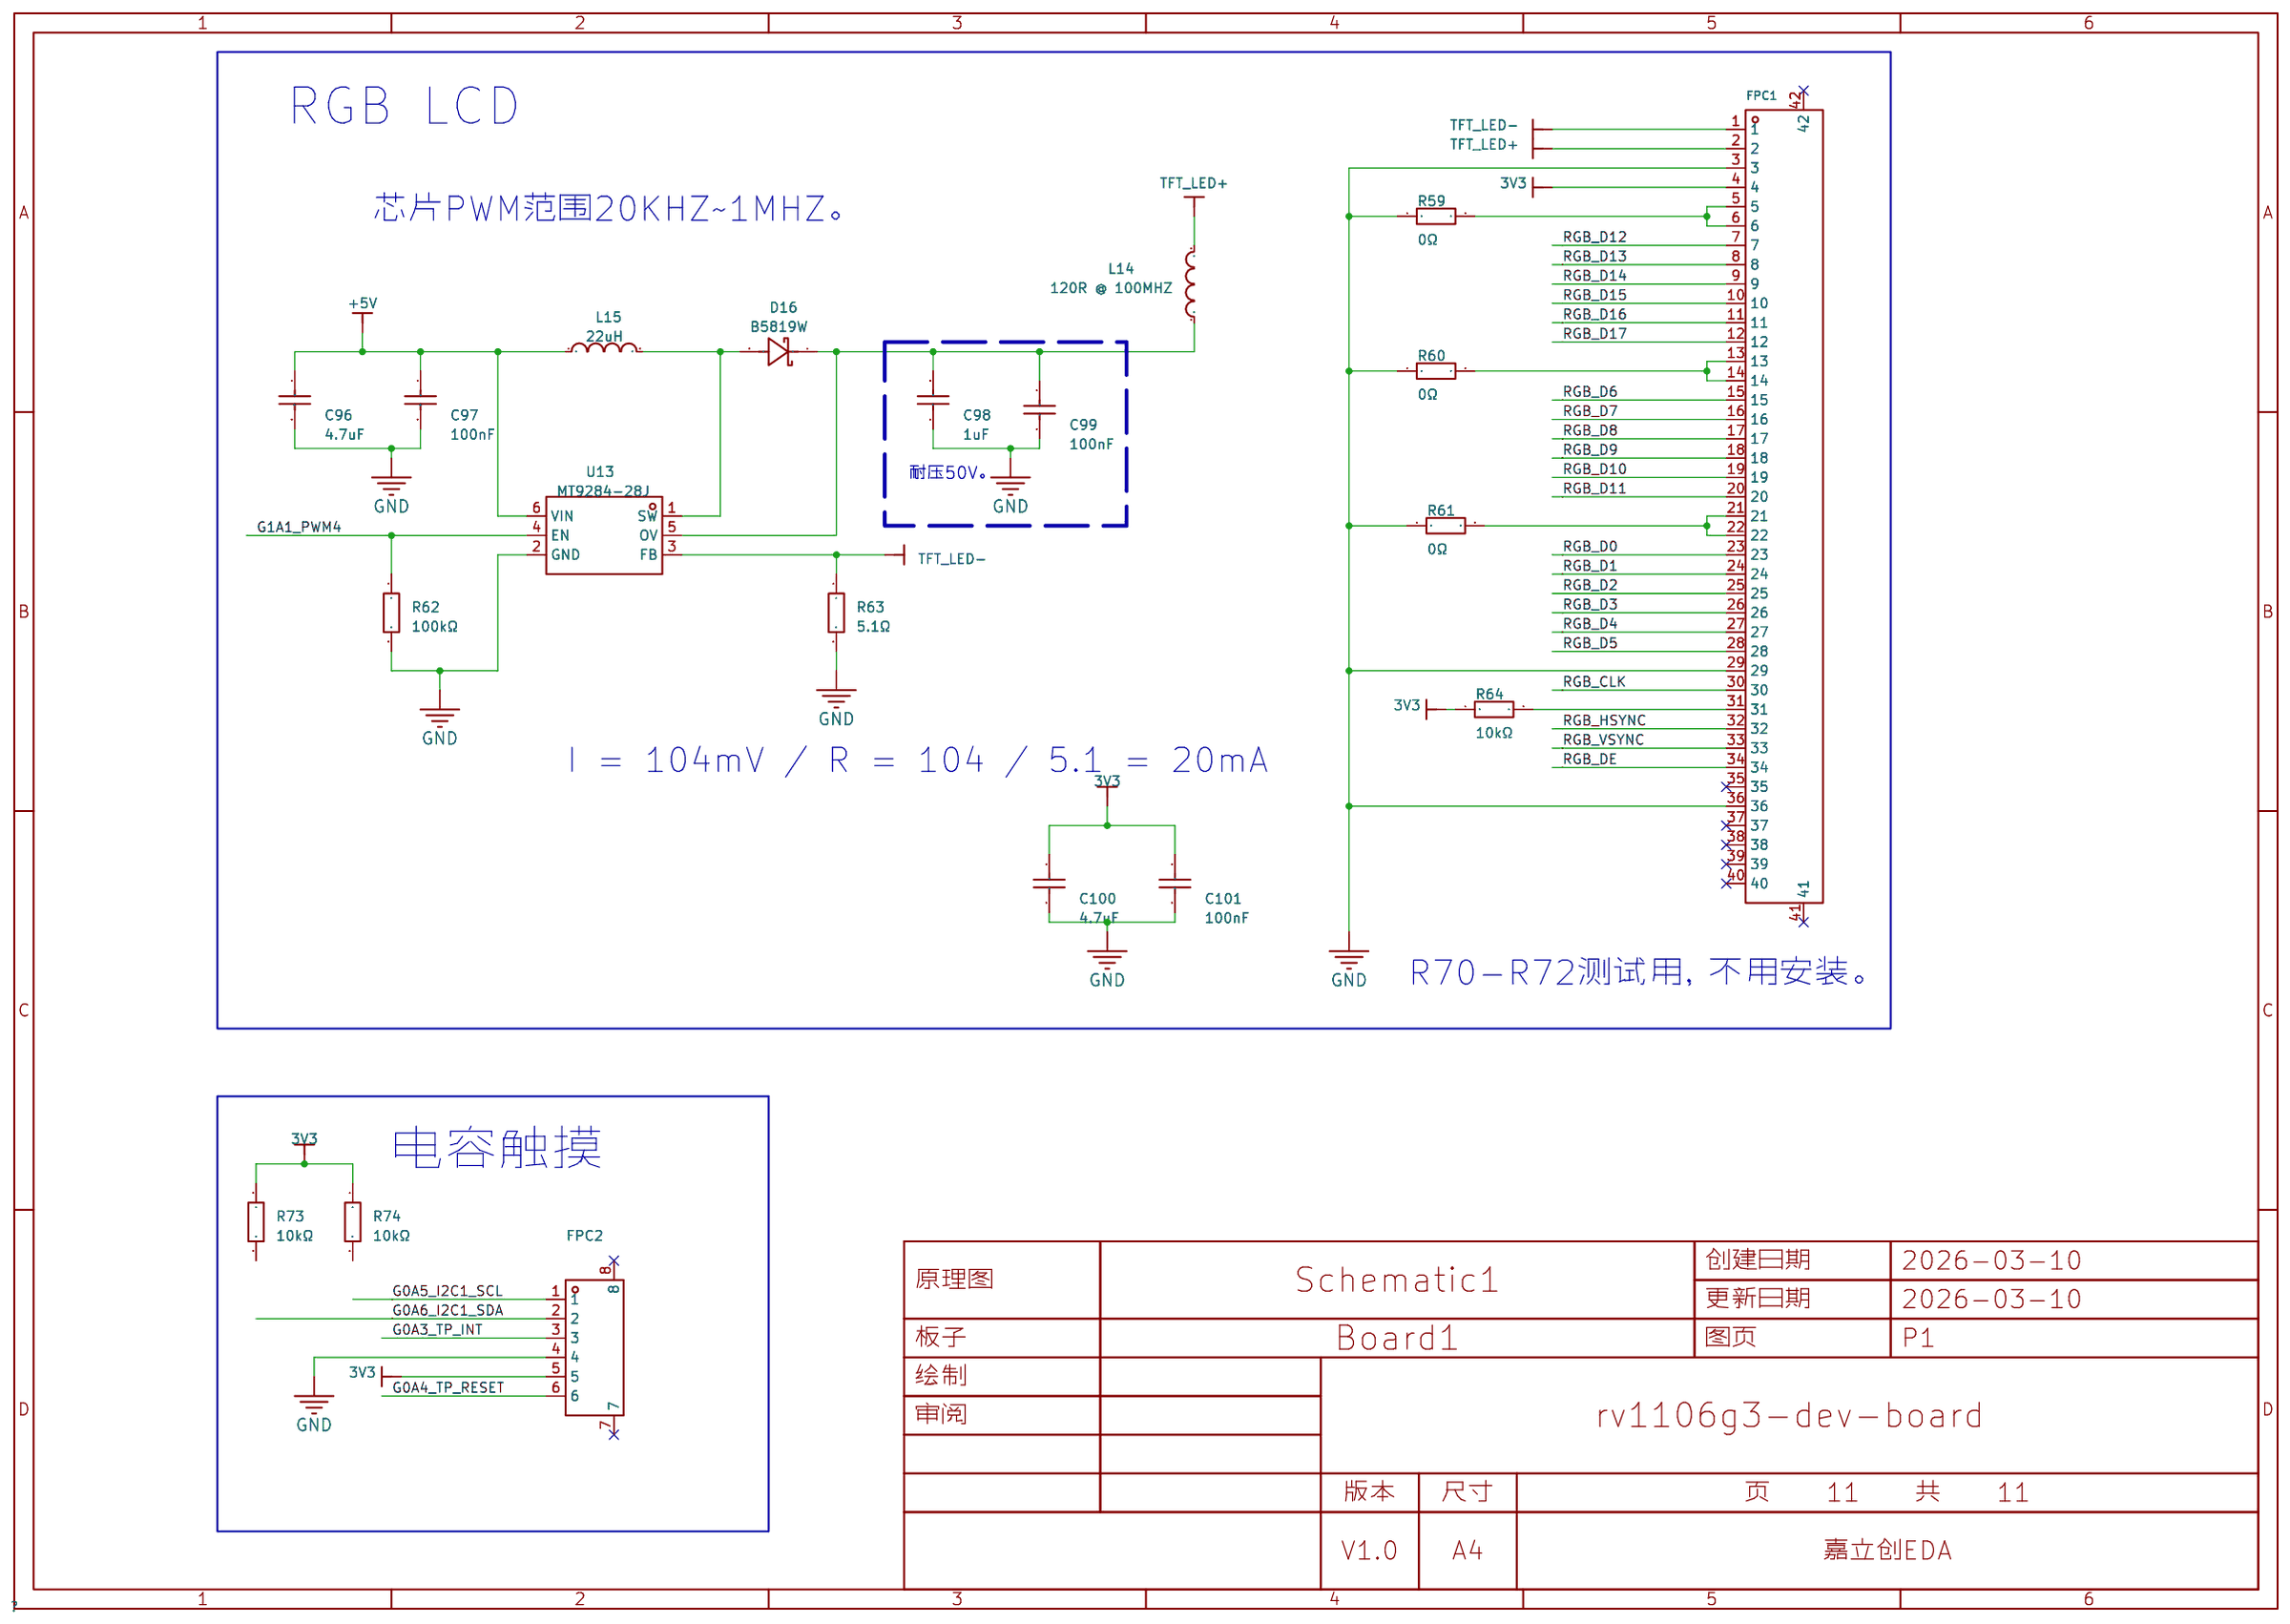
[diagram p10: LCD]
12 CAMERA
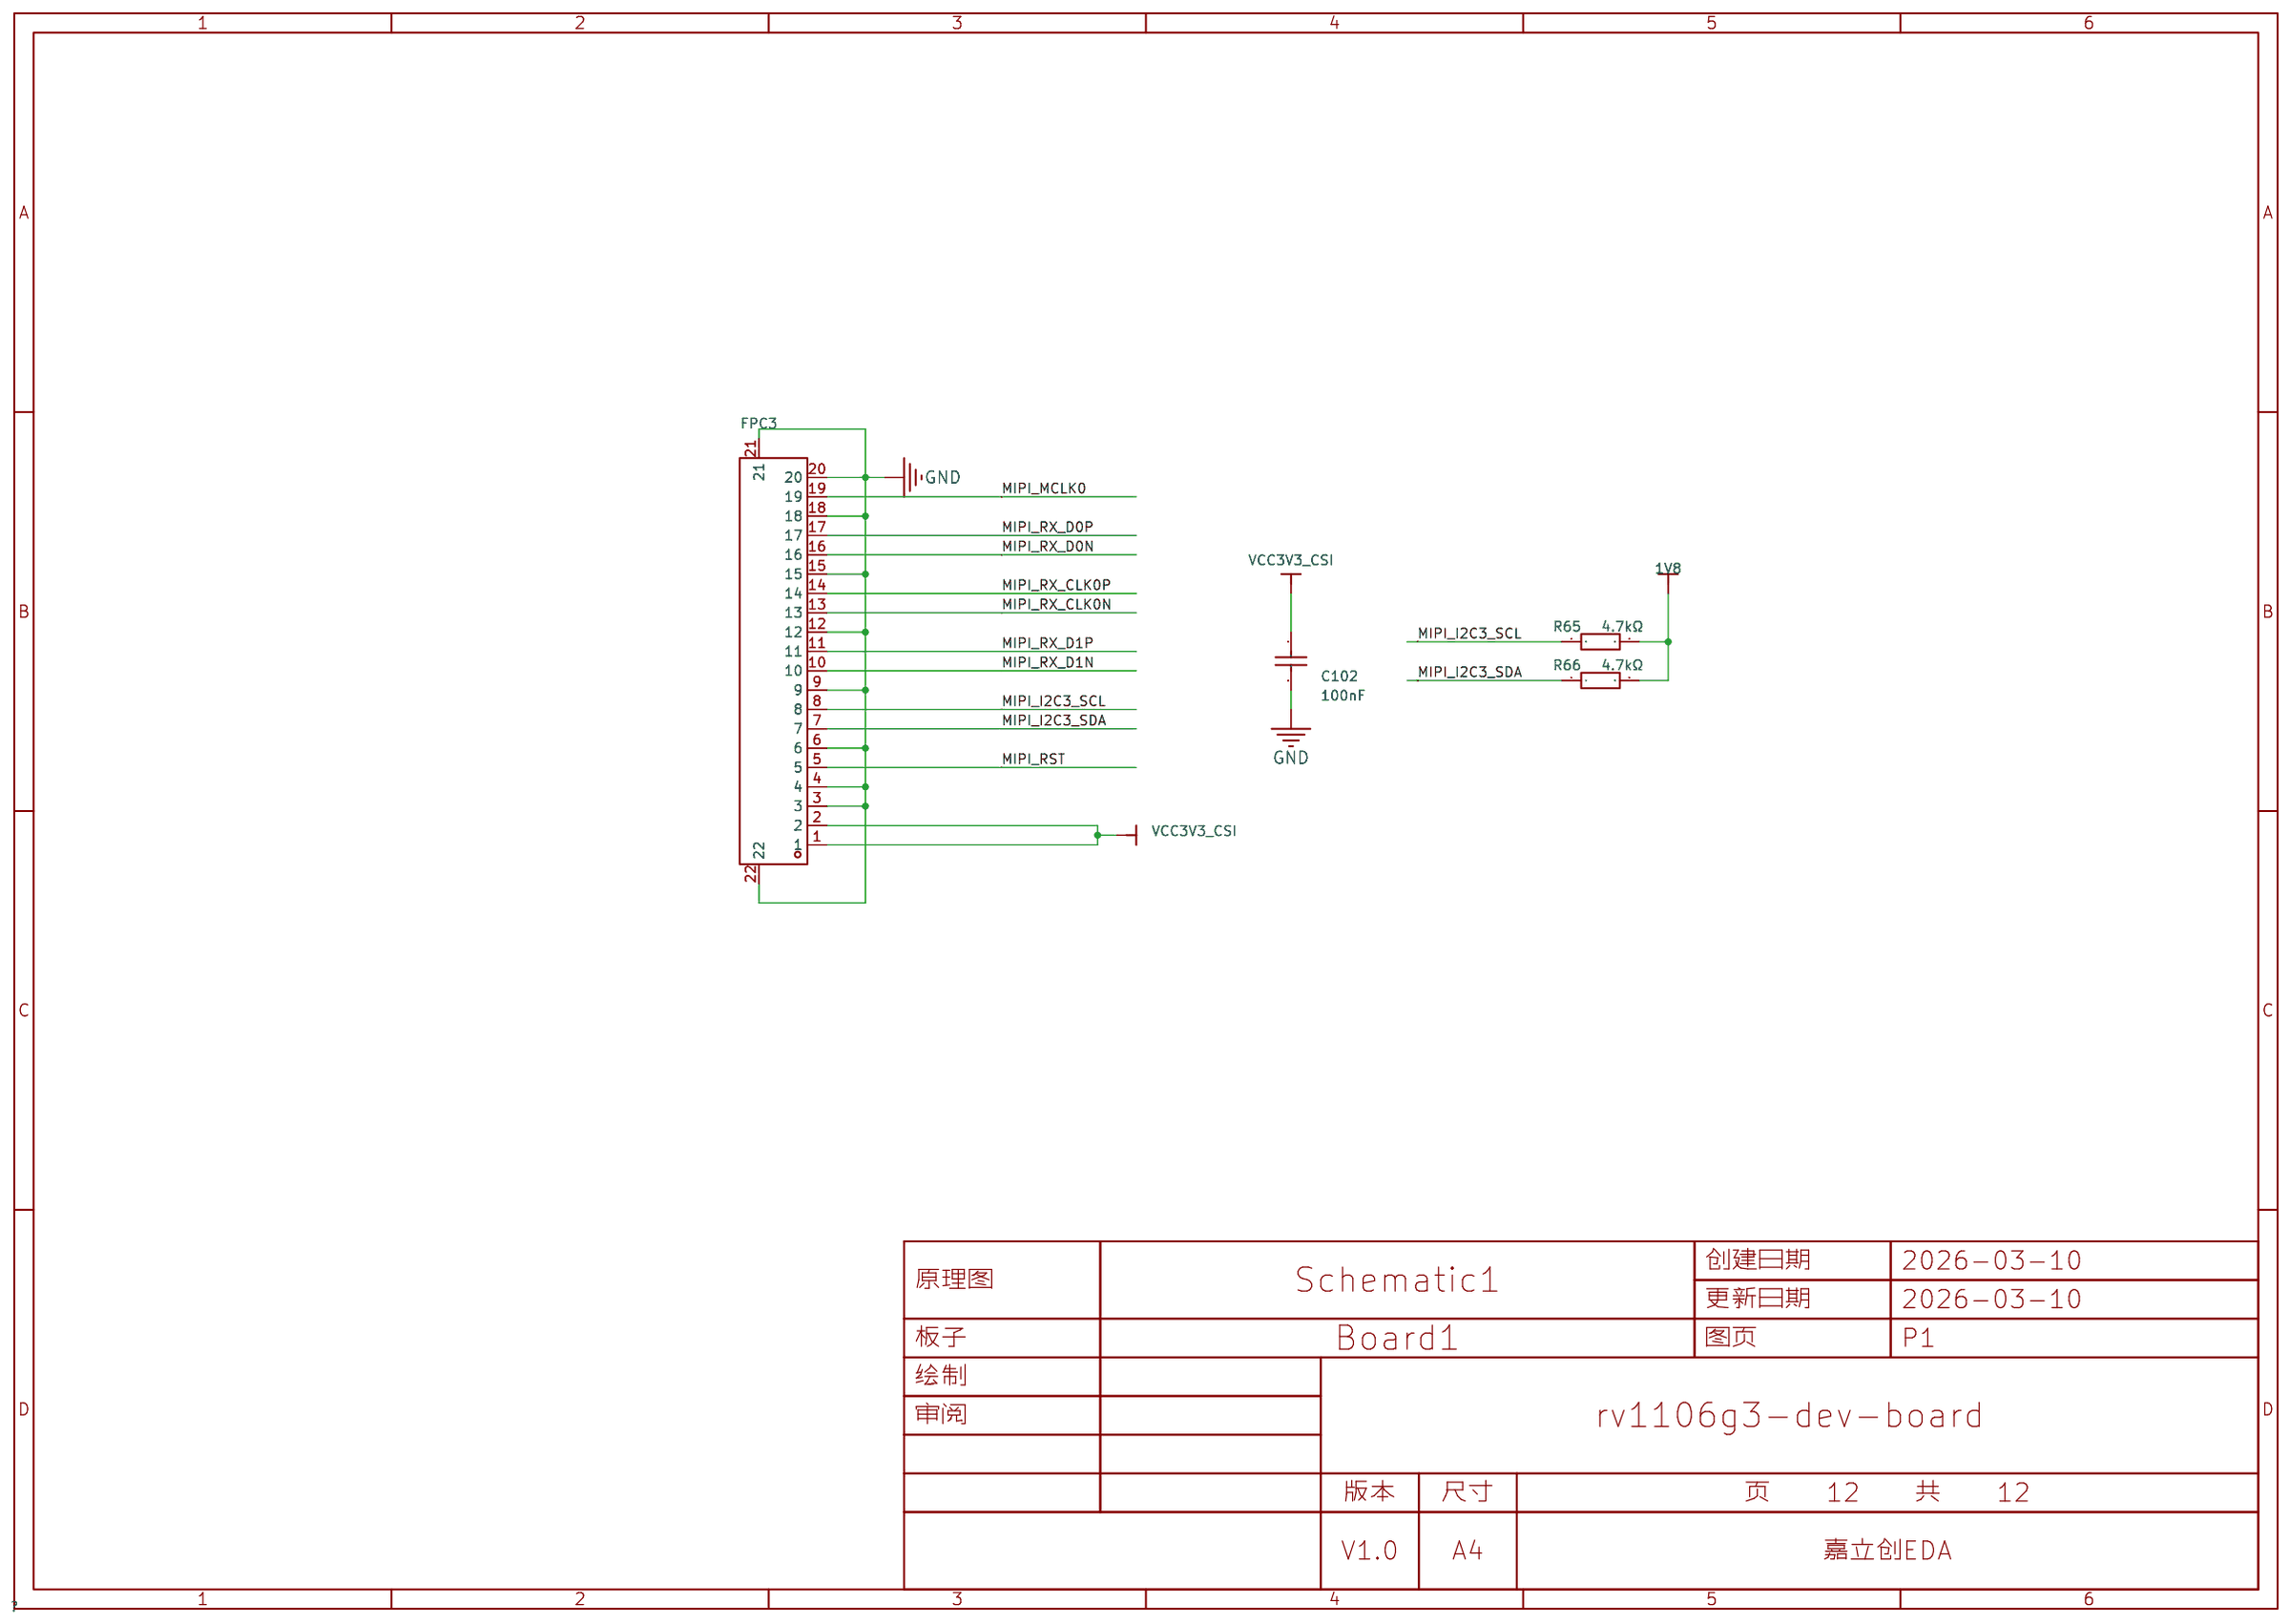
[diagram p11: CAMERA]
13 Wi-Fi: Page Name: P2
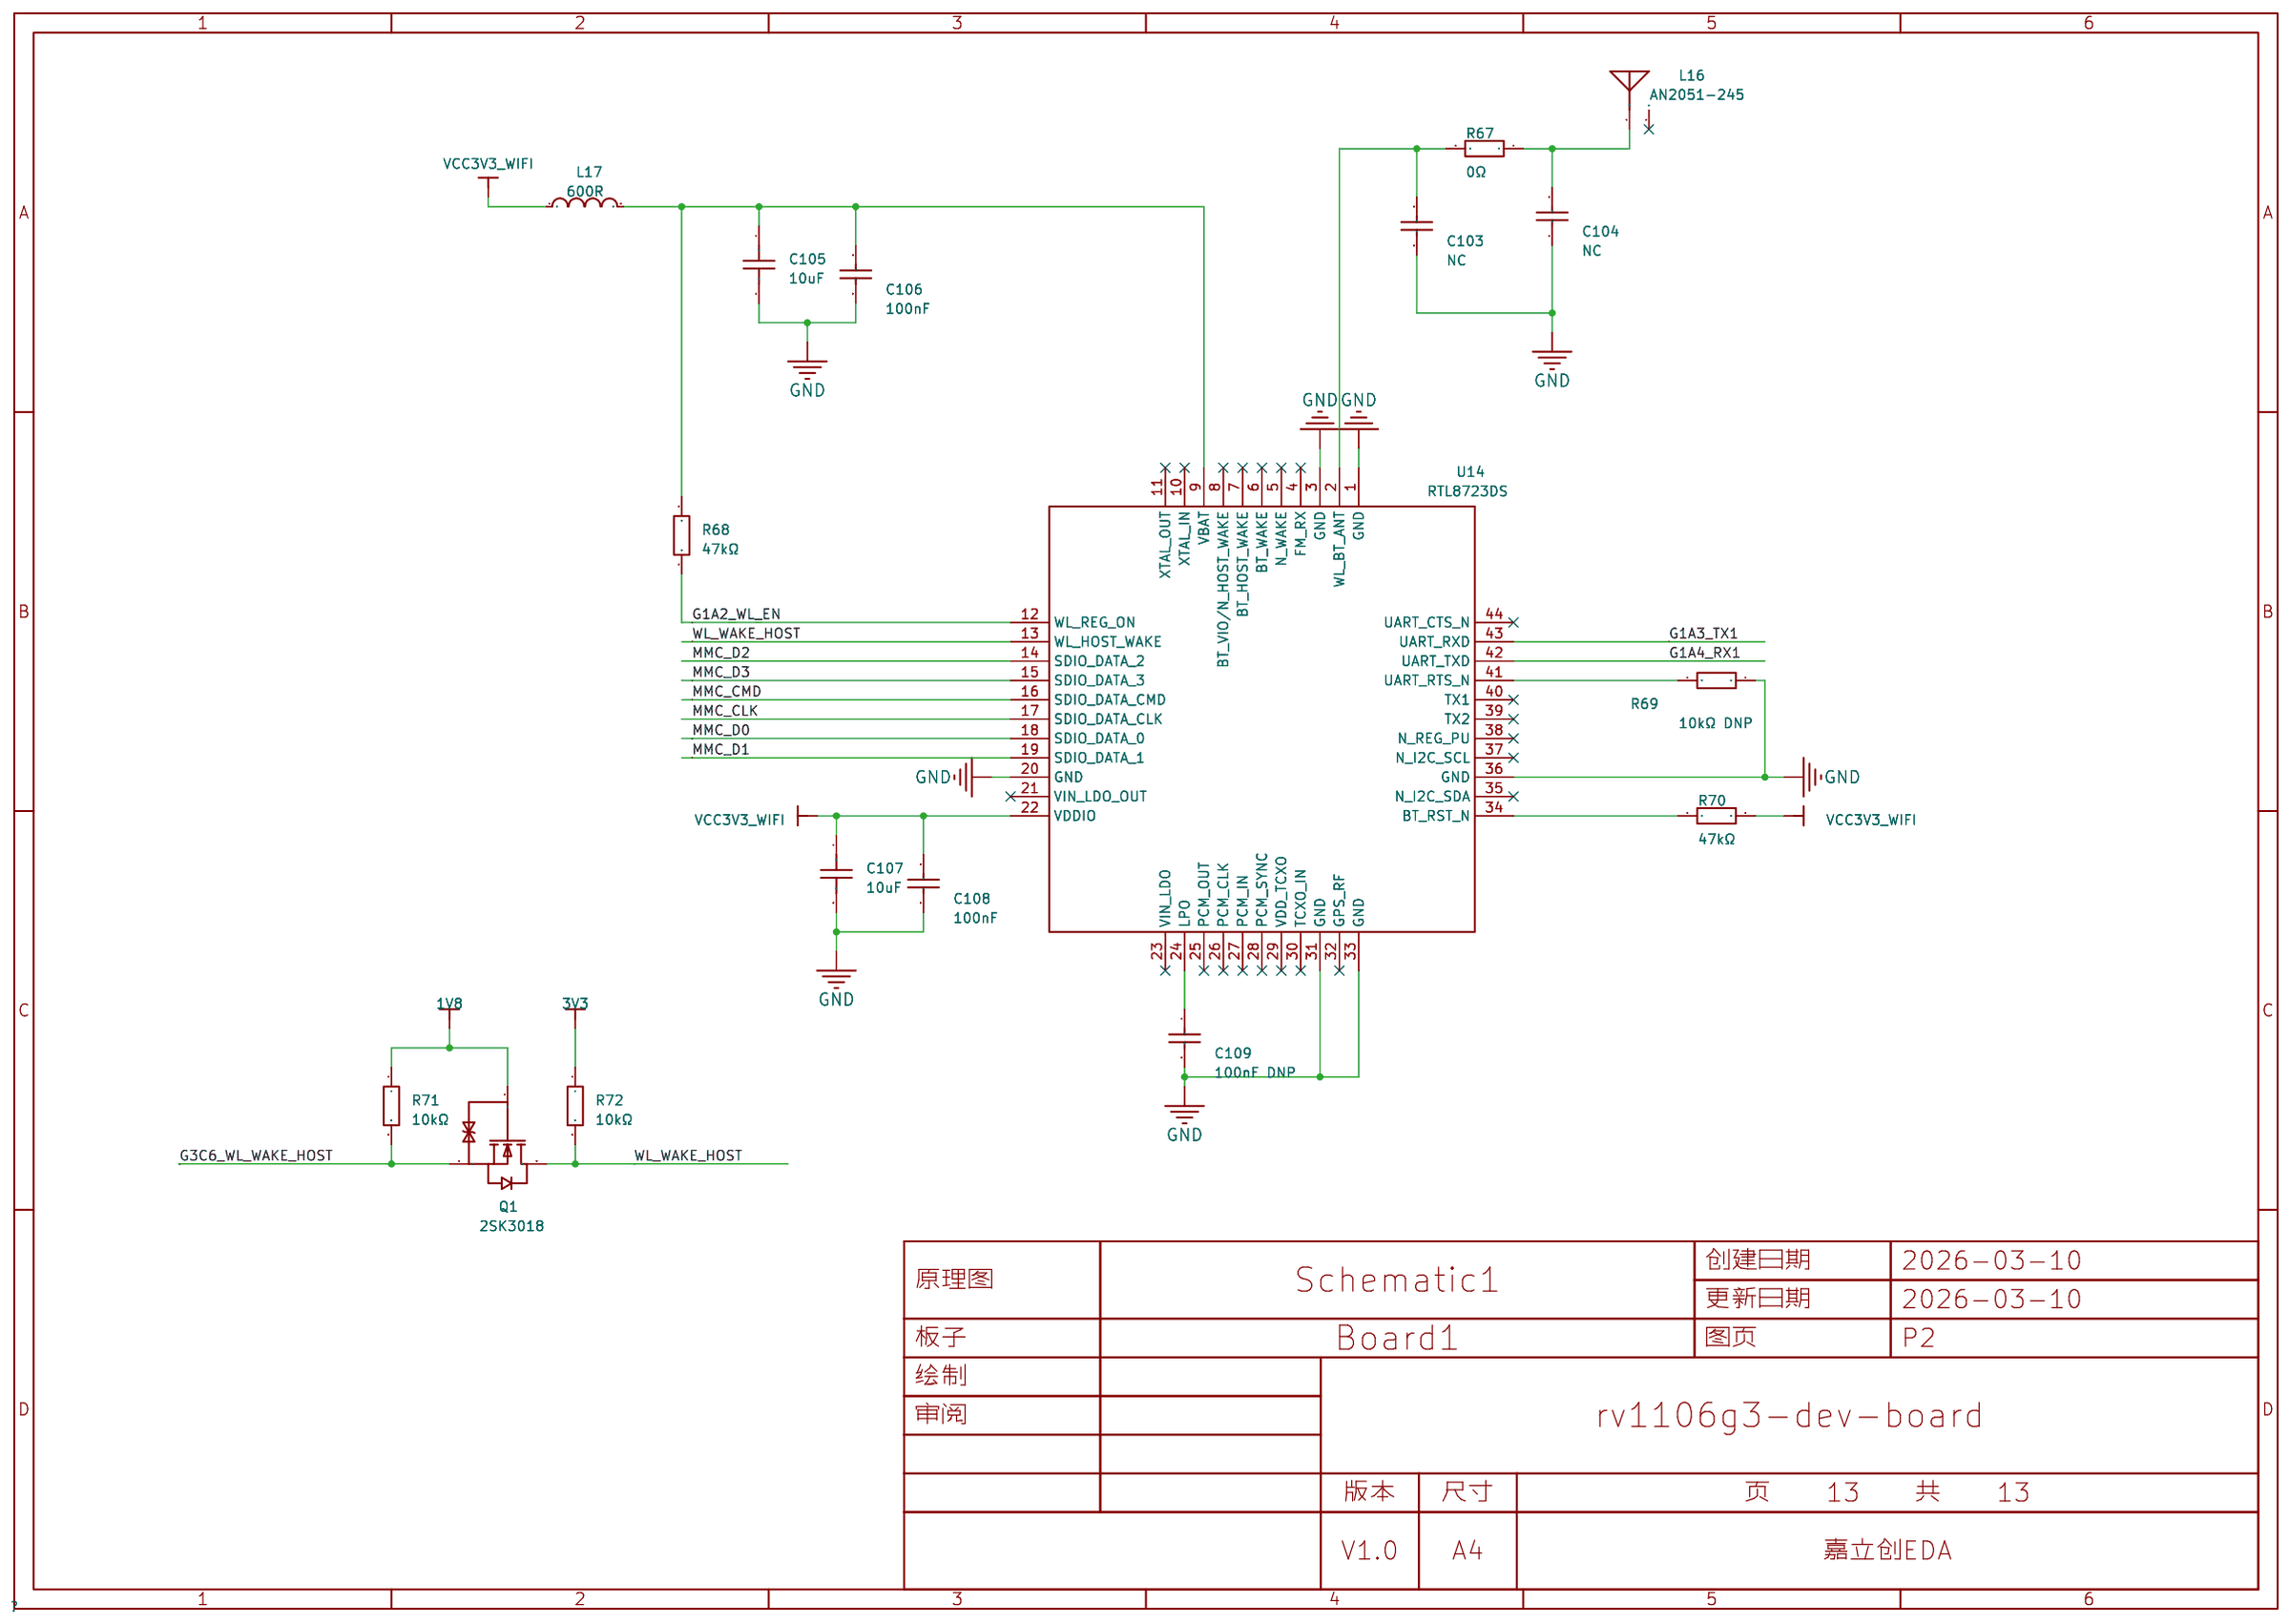
[diagram p12: Wi-Fi]

## Parts
sheet ADC_EMMC_SDMMC
C60  100nF  [C0402]
C61  100nF  [C0402]
L8  120R  [L0603]
L9  120R  [L0603]
R23  22Ω  [R0402_3]
R24  100Ω  [R0402_3]
R25  22Ω  [R0402_3]
sheet AUDIO
C65  100nF  [C0402]
C66  10pF DNP  [C0402]
C67  100nF  [C0402]
C68  1nF  [C0402]
C69  1uF  [C0402]
C70  47nF  [C0402]
C71  100nF  [C0402]
C73  1nF  [C0402]
C111  22uF  [C0603]
H1  -  [HDR-TH_2P-P2.54-V-M-1]
L10  600R  [L1206]
L11  1K 0.5A  [L0805]
L12  1K 0.5A  [L0805]
MIC1  ZTS6216  [MIC-SMD_4P-L2.8-W1.9-P1.84-TL]
R28  100Ω  [R0402_3]
R29  1kΩ  [R0402_3]
R30  1kΩ  [R0402_3]
R31  20kΩ  [R0402_3]
R32  10kΩ  [R0402_3]
R33  30kΩ  [R0402_3]
U7  ZX-MX1.25-2PLT  [CONN-SMD_2P-P1.25-MX1.25-2P-LT]
U8  NS4158  [SOIC-8_L4.9-W3.9-P1.27-LS6.0-BL]
U9  ZX-MX1.25-2PLT  [CONN-SMD_2P-P1.25-MX1.25-2P-LT]
sheet CAMERA
C102  100nF  [C0402]
FPC3  FPC-05F-20PH20  [FPC-SMD_20P-P0.50_XUNPU_FPC-05F-20PH20]
R65  4.7kΩ  [R0402_3]
R66  4.7kΩ  [R0402_3]
sheet ETHERNET_KEY
C74  10nF  [C0402]
C75  100nF  [C0402]
C76  10nF  [C0402]
C77  100nF  [C0402]
C113  1nF  [C1206]
D2  LESD5Z5.0CT1G  [SOD-523_L1.2-W0.8-LS1.6-BI]
D3  LESD5Z5.0CT1G  [SOD-523_L1.2-W0.8-LS1.6-BI]
J1  HR911105A  [RJ45-TH_HR911105A]
R34  10kΩ  [R0402_3]
R35  100Ω  [R0402_3]
R36  0Ω  [R0402_3]
R37  0Ω  [R0402_3]
R38  0Ω  [R0402_3]
R39  0Ω  [R0402_3]
R40  1kΩ  [R0402_3]
R41  1kΩ  [R0402_3]
R42  10kΩ  [R0402_3]
R43  5.1kΩ  [R0402_3]
R44  100Ω  [R0402_3]
R75  1M  [R1206]
SW1  TS3425BA  [SW-SMD_4P-L4.2-W3.2-P2.15-LS4.6-1]
SW2  TS3425BA  [SW-SMD_4P-L4.2-W3.2-P2.15-LS4.6-1]
SW3  TS3425BA  [SW-SMD_4P-L4.2-W3.2-P2.15-LS4.6-1]
sheet FLASH_EMMC
C84  100nF  [C0402]
C85  10uF  [C0603]
C86  4.7uF  [C0402]
C87  100nF  [C0402]
C88  100nF  [C0402]
C89  100nF  [C0402]
C91  4.7uF  [C0402]
C92  100nF  [C0402]
C93  100nF  [C0402]
C110  1uF  [C0402]
R54  10kΩ  [R0402_3]
R55  10kΩ  [R0402_3]
R56  4.7kΩ  [R0402_3]
R57  10kΩ  [R0402_3]
R58  10kΩ  [R0402_3]
U11  W25N02KVZEIR  [WSON-8_L8.0-W6.0-P1.27-TL-EP-1]
U12  -  [FBGA-153_L13.0-W11.5-P0.50_KLMAG1JETD-B041]
sheet LCD
C96  4.7uF  [C0402]
C97  100nF  [C0402]
C98  1uF  [C0402]
C99  100nF  [C0402]
C100  4.7uF  [C0402]
C101  100nF  [C0402]
D16  B5819W  [SOD-123F_L2.7-W1.6-LS3.8-RD-1]
FPC1  0.5K-AS-40PWBG  [FPC-SMD_40P-P0.50_0.5K-AS-40PWB]
FPC2  FPC-05F-6PH20  [FPC-SMD_6P-P0.50_XUNPU_FPC-05F-6PH20]
L14  120R @ 100MHZ  [L0603]
L15  22uH  [IND-SMD_L2.5-W2.0_SWPA252012S]
R59  0Ω  [R0402_3]
R60  0Ω  [R0402_3]
R61  0Ω  [R0402_3]
R62  100kΩ  [R0402_3]
R63  5.1Ω  [R0402_3]
R64  10kΩ  [R0402_3]
R73  10kΩ  [R0402_3]
R74  10kΩ  [R0402_3]
U13  MT9284-28J  [SOT-23-6_L2.9-W1.6-P0.95-LS2.8-BR]
sheet OSC_RTC_PMU_IO1
C50  22pF  [C0402]
C51  100nF  [C0402]
C52  22pF  [C0402]
C53  NC  [C0402]
C54  100nF  [C0402]
C55  NC  [C0402]
C56  1uF  [C0402]
C57  100nF  [C0402]
C58  100nF  [C0402]
C59  100nF  [C0402]
L7  120R@100MHZ  [L0603]
R21  22Ω  [R0402_3]
R22  1MΩ  [R0402_3]
X1  24MHz  [CRYSTAL-SMD_4P-L3.2-W2.5-BL]
X2  32.768kHz  [OSC-SMD_L3.2-W1.5]
sheet POWER
C1  22pF DNP  [C0402]
C2  10uF  [C0603]
C3  22uF  [C0603]
C4  100nF  [C0402]
C6  22pF DNP  [C0402]
C7  10uF  [C0603]
C8  22uF  [C0603]
C9  100nF  [C0402]
C10  100nF  [C0402]
C11  22pF DNP  [C0402]
C12  10uF  [C0603]
C13  22uF  [C0603]
C14  22pF DNP  [C0402]
C15  100nF  [C0402]
C16  10uF  [C0603]
C17  22uF  [C0603]
C18  100nF  [C0402]
C19  100nF  [C0402]
C20  100nF  [C0402]
C112  NC  [C0402]
D1  BAT54C  [SOT-23-3_L2.9-W1.6-P1.90-LS2.8-BR]
L1  2.2uH  [IND-SMD_L2.5-W2.0-1]
L2  120R@100MHZ  [L0603]
L3  2.2uH  [IND-SMD_L2.5-W2.0-1]
L4  2.2uH  [IND-SMD_L2.5-W2.0-1]
L5  2.2uH  [IND-SMD_L2.5-W2.0-1]
LED1  -  [LED_0603]
R1  10kΩ  [R0402_3]
R2  100kΩ  [R0402_3]
R3  200kΩ  [R0402_3]
R4  1Ω  [R0402_3]
R5  100kΩ  [R0402_3]
R6  240kΩ  [R0402_3]
R7  1Ω  [R0402_3]
R8  191kΩ  [R0402_3]
R9  200kΩ  [R0402_3]
R10  680kΩ  [R0402_3]
R11  2kΩ  [R0402_3]
R12  100kΩ  [R0402_3]
R13  200kΩ  [R0402_3]
R14  150kΩ  [R0402_3]
R15  100kΩ  [R0402_3]
R16  1kΩ  [R0402_3]
R17  100Ω  [R0402_3]
U2  MT3520B  [SOT-23-5_L3.0-W1.7-P0.95-LS2.8-BR]
U3  MT3520B  [SOT-23-5_L3.0-W1.7-P0.95-LS2.8-BR]
U4  MT3520B  [SOT-23-5_L3.0-W1.7-P0.95-LS2.8-BR]
U5  MT3520B  [SOT-23-5_L3.0-W1.7-P0.95-LS2.8-BR]
U6  ZX-MX1.25-2PLT  [CONN-SMD_2P-P1.25-MX1.25-2P-LT]
sheet PWR_CODEC_ETH_USB
C21  1uF  [C0402]
C22  1uF  [C0402]
C23  4.7uF  [C0402]
C24  100nF  [C0402]
C25  4.7uF  [C0402]
C26  1uF  [C0402]
C27  100nF  [C0402]
C28  100nF  [C0402]
C29  100nF  [C0402]
C30  10uF  [C0603]
C31  10uF  [C0603]
C32  1uF  [C0402]
C33  1uF  [C0402]
C34  100nF  [C0402]
C35  100nF  [C0402]
C36  100nF  [C0402]
C37  100nF  [C0402]
C38  100nF  [C0402]
C39  100nF  [C0402]
C40  100nF  [C0402]
C41  10uF  [C0603]
C42  1uF  [C0402]
C43  100nF  [C0402]
C44  10uF  [C0603]
C45  10uF  [C0603]
C46  1uF  [C0402]
C47  100nF  [C0402]
C48  1uF  [C0402]
C49  100nF  [C0402]
L6  120R@100MHZ  [L0603]
R18  0Ω  [R0402_3]
R19  240Ω  [R0402_3]
R20  6.04kΩ  [R0402_3]
U1  -  [QFN-128_L12.3-W12.3-P0.35-TL-EP7.0-1]  (sections 1,2,3,4)
sheet RGB_MIPI
C62  100nF  [C0402]
C63  100nF  [C0402]
C64  100nF  [C0402]
LED2  -  [LED_0603]
R26  22Ω  [R0402_3]
R27  1kΩ  [R0402_3]
sheet TF-Card
C94  100nF  [C0402]
C95  10uF  [C0603]
CARD1  TF-01A  [TF-SMD_TF-02]
L13  120R  [L0603]
sheet USB_GPIO
C78  100nF  [C0402]
C79  4.7uF  [C0402]
C80  2.2uF  [C0402]
C81  22uF  [C0603]
C82  100nF  [C0402]
C83  100nF  [C0402]
D4  LESD5Z5.0CT1G  [SOD-523_L1.2-W0.8-LS1.6-BI]
D5  LESD5Z5.0CT1G  [SOD-523_L1.2-W0.8-LS1.6-BI]
D6  SS34  [SMA_L4.3-W2.5-LS5.0-RD]
D7  LESD5Z5.0CT1G  [SOD-523_L1.2-W0.8-LS1.6-BI]
D8  LESD5Z5.0CT1G  [SOD-523_L1.2-W0.8-LS1.6-BI]
H3  -  [HDR-TH_6P-P2.54-V-M-1]
H4  -  [HDR-TH_6P-P2.54-V-R2-C3-S2.54_A2541WV-2X3P]
LED3  -  [LED_0603]
LED4  -  [LED_0603]
LED5  -  [LED_0603]
R45  4.7kΩ  [R0402_3]
R46  4.7kΩ  [R0402_3]
R47  10kΩ  [R0402_3]
R48  2.2Ω  [R0402_3]
R49  2.2Ω  [R0402_3]
R50  15kΩ  [R0402_3]
R51  5.1kΩ  [R0402_3]
R52  2kΩ  [R0402_3]
R53  5.1kΩ  [R0402_3]
U10  CH340E  [MSOP-10_L3.0-W3.0-P0.50-LS5.0-BL]
USB2  HC-TYPE-C-16P-01A  [USB-C-SMD_HC-TYPE-C-16P-01A]
USB3  USB-231-ARY  [USB-A-TH_USB-231-ARY]
sheet Wi-Fi
C103  NC  [C0402]
C104  NC  [C0402]
C105  10uF  [C0603]
C106  100nF  [C0402]
C107  10uF  [C0603]
C108  100nF  [C0402]
C109  100nF DNP  [C0402]
L16  AN2051-245  [ANT2051]
L17  600R  [L1206]
Q1  2SK3018  [SOT-23-3_L2.9-W1.3-P1.90-LS2.4-BR]
R67  0Ω  [R0402_3]
R68  47kΩ  [R0402_3]
R69  10kΩ DNP  [R0402_3]
R70  47kΩ  [R0402_3]
R71  10kΩ  [R0402_3]
R72  10kΩ  [R0402_3]
U14  RTL8723DS  [RTL8723DS]

## Library data of the parts
C1 C4 C6 C9-C11 C14 C15 C18-C29 C32-C40 C42 C43 C46-C71 C73-C80 C82-C84 C86-C89 C91-C94 C96-C104 C106 C108-C110 C112 = CL05B104KO5NNNC: 容值:100nF;精度:±10%;额定电压:16V;材质(温度系数):X7R;; LCSC Part Name: 100nF ±10% 16V; Supplier Part: C1525; Manufacturer: SAMSUNG(三星); Manufacturer Part: CL05A105KA5NQNC; Supplier Footprint: 0402; Datasheet: https://atta.szlcsc.com/upload/public/pdf/source/20160218/1457707763339.pdf; Supplier: LCSC; Tolerance: ±10%; Voltage Rated: 16V; Temperature Coefficient: X7R; Check: true
L2 L6-L9 L13 = BLM18PG121SN1D: 标称阻抗@测试频率:120Ω@100MHz;误差:±25%;直流电阻(RDC):50mΩ;; LCSC Part Name: 单路 0603磁珠 阻抗120Ω@100MHz; Supplier Part: C14709; Manufacturer: muRata(村田); Supplier Footprint: 0603; JLCPCB Part Class: 扩展库; Datasheet: https://atta.szlcsc.com/upload/public/pdf/source/20130704/1457706621422.pdf; Supplier: LCSC; Impedance @ Frequency: 120Ω@100MHz; Tolerance: ±25%; DC Resistance: 50mΩ; Current Rating: 2A; Circuits: 1
R1-R74 = RC0402FR-07232KL: 电阻类型:厚膜电阻;阻值:232kΩ;精度:±1%;功率:62.5mW;; LCSC Part Name: 232kΩ ±1% 62.5mW; Supplier Part: C309542; Manufacturer: YAGEO(国巨); Supplier Footprint: 0402; JLCPCB Part Class: Extended Part; Datasheet: https://atta.szlcsc.com/upload/public/pdf/source/20181009/C309542_CA3F4488430805647C87B9489F02B718.pdf; Supplier: LCSC; Type: 厚膜电阻; Tolerance: ±1%; Power(Watts): 62.5mW; Temperature Coefficient: ±100ppm/℃; Overload Voltage (Max): 50V; Operating Temperature Range: -55℃~+155℃
C2 C3 C7 C8 C12 C13 C16 C17 C30 C31 C41 C44 C45 C81 C85 C95 C105 C107 C111 = CL10A106KP8NNNC: 容值:10uF;精度:±10%;额定电压:10V;温度系数:X5R;; LCSC Part Name: 10uF ±10% 10V; Supplier Part: C19702; Manufacturer: SAMSUNG(三星); Supplier Footprint: 0603; JLCPCB Part Class: Basic Part; Datasheet: https://item.szlcsc.com/datasheet/CL10A106KP8NNNC/20411.html; Supplier: LCSC; Tolerance: ±10%; Voltage Rating: 10V; Temperature Coefficient: X5R
H1 = HDR-M_2.54_1x2P: Supplier Part: C124375; Supplier Footprint: 插件
L10 L17 = CBW321609U601T: 标称阻抗@测试频率:600Ω@100MHz;误差:±25%;直流电阻(RDC):250mΩ;; LCSC Part Name: 单路 1206磁珠 阻抗600Ω@100MHz; Supplier Part: C73732; Manufacturer: FH(风华); Supplier Footprint: 1206; JLCPCB Part Class: 扩展库; Datasheet: https://atta.szlcsc.com/upload/public/pdf/source/20190129/C361676_507080CDC8DBC2B0B7C2139C1873642D.pdf; Supplier: LCSC; Impedance @ Frequency: 600Ω@100MHz; Tolerance: ±25%; DC Resistance: 250mΩ; Current Rating: 2A; Circuits: 1
L11 L12 = SBK201209T-102Y-N: 标称阻抗@测试频率:1kΩ@100MHz;误差:±25%;直流电阻(RDC):500mΩ;; LCSC Part Name: 单路 0805磁珠 阻抗1000Ω@100MHz; Supplier Part: C142036; Manufacturer: chilisin(奇力新); Supplier Footprint: 0805; JLCPCB Part Class: 扩展库; Datasheet: https://atta.szlcsc.com/upload/public/pdf/source/20181119/C285644_F4950E68CEB7BD9E18B05382B5272067.pdf; Supplier: LCSC; Impedance @ Frequency: 1kΩ@100MHz; Tolerance: ±25%; DC Resistance: 500mΩ; Current Rating: 200mA; Circuits: 1
MIC1 = ZTS6216: 方向:全指向;信噪比:65dB;灵敏度:-38dB;阻抗:100Ω;; Supplier Part: C481302; Manufacturer: ZILLTEK(钰太); Supplier Footprint: SMD-4P,1.9x2.8mm; JLCPCB Part Class: 扩展库; Datasheet: https://atta.szlcsc.com/upload/public/pdf/source/20200316/C481302_3CBECE2A7DED4DFD53CEA082844189F4.pdf; Supplier: LCSC; Direction: 全指向; Supply Voltage: 1.5V~3.6V; Current Consumption: 120uA; SNR(Signal to Noise Ratio): 65dB; Sensitivity: -38dB; Impedance: 100Ω
U6 U7 U9 = ZX-MX1.25-2PLT: 插针结构:1x2P;间距:1.25mm;安装方式:立贴;参考系列:PicoBlade(MX 1.25);总PIN数:2P;排数:1;每排PIN数:2;行距:-;额定电流:1A;触头材质:黄铜;触头镀层:锡;工作温度:-25℃~+85℃;; LCSC Part Name: 1x2P 间距:1.25mm 立贴 系列:PicoBlade(MX 1.25); Supplier Part: C7430473; Manufacturer: Megastar(兆星); Supplier Footprint: SMD,P=1.25mm; JLCPCB Part Class: Extended Part; Datasheet: https://item.szlcsc.com/datasheet/ZX-MX1.25-2PLT/8430342.html; Supplier: LCSC; Pins Structure: 1x2P; Pitch: 1.25mm; Mounting Type: 立贴; Reference Series: PicoBlade(MX 1.25); Number of Pins: 2P; Number of Rows: 1; Number of PINs Per Row: 2; Current Rating: 1A; Contact Material: 黄铜; Contact Plating: 锡; Operating Temperature: -25℃~+85℃; Voltage Rating: 125V; Plastic Material: LCP; Supplementary Features: 辅助焊脚; Color: 米色; Z-Height of the Board: 4.7mm; X-Length of Bottom Edge on Board (Spacing Line): 7.5mm; Y-Width of Bottom Edge on Board: 4.3mm
U8 = NS4158: Supplier Part: C2890042; Manufacturer: Nsiway(纳芯威); Supplier Footprint: SOIC-8; JLCPCB Part Class: 扩展库; Datasheet: https://atta.szlcsc.com/upload/public/pdf/source/20210826/9C0306C24076E9EB95F6FF2952664B70.pdf; Supplier: LCSC
FPC3 = FPC-05F-20PH20: 锁定特性:翻盖式;触点类型:下接;触点数量:20P;间距:0.5mm;安装类型:卧贴;工作温度范围:-25℃~+85℃;; LCSC Part Name: 间距:0.5mm P数:20P 翻盖式 下接; Supplier Part: C2856803; Manufacturer: XUNPU(讯普); Supplier Footprint: SMD,P=0.5mm,卧贴; JLCPCB Part Class: 扩展库; Datasheet: https://atta.szlcsc.com/upload/public/pdf/source/20210922/C2856803_40AC94077DCDAD136B773224EC50E565.pdf; Supplier: LCSC; Locking Feature: 翻盖式; Contact Type: 下接; Number of Contacts: 20P; Pitch: 0.5mm; Mounting Type: 卧贴; FFC, FCB Thickness: 0.3mm; Height Above Board: 2mm; Operating Temperature Range: -25℃~+85℃
C113 = 1206B102K202NT: 容值:1nF;精度:±10%;额定电压:2kV;材质(温度系数):X7R;; LCSC Part Name: 1nF ±10% 2kV; Supplier Part: C9196; Manufacturer: FH(风华); Supplier Footprint: 1206; JLCPCB Part Class: 基础库; Datasheet: https://atta.szlcsc.com/upload/public/pdf/source/20200305/C486355_26A10D38EF8C2A5C37091D0039909270.pdf; Supplier: LCSC; Tolerance: ±10%; Voltage Rated: 2kV; Temperature Coefficient: X7R
D2-D5 D7 D8 = LESD5Z5.0CT1G: 极性:双向;反向截止电压(Vrwm):5V;最大钳位电压:18.6V;峰值脉冲电流(Ipp)@10/1000us:9.4A;击穿电压:5.6V;; LCSC Part Name: 双向ESD; Supplier Part: C136167; Manufacturer: LRC(乐山无线电); Supplier Footprint: SOD-523; JLCPCB Part Class: 扩展库; Datasheet: https://atta.szlcsc.com/upload/public/pdf/source/20171026/C136167_15089841930291059137.pdf; Supplier: LCSC; polarity: 双向; Reverse Stand-Off Voltage (Vrwm): 5V; Maximum Clamping Voltage: 18.6V; Peak Pulse Current (Ipp)@10/1000us: 9.4A; Breakdown Voltage: 5.6V; Type: ESD
J1 = HR911105A_C12074: 连接器类型:RJ45插座;端口数量:1;安装方式:-;屏蔽:-;LED:带LED;等级:-;触头材质:-;触头镀层:-;工作温度范围:-;焊接温度(最大值):-;; LCSC Part Name: 带LED; Supplier Part: C12074; Manufacturer: HANRUN(汉仁); Supplier Footprint: 插件; JLCPCB Part Class: 扩展库; Datasheet: https://atta.szlcsc.com/upload/public/pdf/source/20170918/C12074_1505726819496976146.pdf; Supplier: LCSC; Connector Type: RJ45插座; Number of Ports: 1; LED: 带LED; PoE: 不带PoE; Supplementary Features: 带滤波
R75 = Res_1206: Supplier Footprint: 1206
SW1-SW3 = TS3425BA: 电路结构:单刀单掷;按钮形状:椭圆形按钮;作用力:2.5N;安装方式:立贴;开关长度:4.2mm;开关宽度:3.2mm;开关高度:2.5mm;带支架:不带支架;触点电流:50mA;额定电压:12V;工作寿命:10万次;; LCSC Part Name: 4.2*3.2*2.5mm 立贴 轻触开关; Supplier Part: C2681476; Manufacturer: SHOU HAN(首韩); Supplier Footprint: SMD; JLCPCB Part Class: Extended Part; Datasheet: https://item.szlcsc.com/datasheet/TS3425BA/2774819.html; Supplier: LCSC; Circuit: 单刀单掷; Actuator Style: 椭圆形按钮; Operating Force: 2.5N; Mounting Type: 立贴; Length: 4.2mm; Width: 3.2mm; Switch Height: 2.5mm; with Bracket: 不带支架; Contact Current: 50mA; Voltage Rating: 12V; Actuator/Cap Color: 白色; Termination Style: J型引脚; Life: 10万次; Operating Temperature: -20℃~+85℃
U11 = W25N02KVZEIR: Supplier Part: C3010298; Manufacturer: WINBOND(华邦); Supplier Footprint: WSON-8-EP(6x8); JLCPCB Part Class: 扩展库; Datasheet: https://atta.szlcsc.com/upload/public/pdf/source/20220505/C090F1E2BB2A9863010E87EB75989FCD.pdf; Supplier: LCSC
U12 = EMMC: Supplier Part: C524518
D16 = B5819W: 二极管配置:-;直流反向耐压(Vr):40V;平均整流电流(Io):1A;正向压降(Vf):580mV@1A;; LCSC Part Name: 40V 1A 580mV@1A; Supplier Part: C2943878; Manufacturer: GOODWORK(固得沃克); Supplier Footprint: SOD-123; JLCPCB Part Class: Extended Part; Datasheet: https://atta.szlcsc.com/upload/public/pdf/source/20220114/81042131F39C8520B6390246D7392C1A.pdf; Supplier: LCSC; Reverse Voltage (Vr): 40V; Average Rectified Current (Io): 1A; Forward Voltage (Vf@If): 580mV@1A; Reverse Leakage Current (Ir): 50uA@40V
FPC1 = 0.5K-AS-40PWBG_C2911822: 间距:0.5mm;触点数量:40P;锁定特性:抽屉式;安装类型:卧贴;触点类型:上接;工作温度范围:-20℃~+85℃;; LCSC Part Name: 0.5mm P数:40P 抽屉式 上接; Supplier Part: C2911822; Manufacturer: HDGC(华德共创); Supplier Footprint: SMD,P=0.5mm; JLCPCB Part Class: 扩展库; Datasheet: https://atta.szlcsc.com/upload/public/pdf/source/20211029/4AF02617E6BD778EA0CE4830DD18C14E.pdf; Supplier: LCSC; Pitch: 0.5mm; Number of Contacts: 40P; Locking Feature: 抽屉式; Mounting Type: 卧贴; Contact Type: 上接; Height Above Board: 2mm; FFC, FCB Thickness: 0.3mm; Operating Temperature Range: -20℃~+85℃
FPC2 = FPC-05F-6PH20: 锁定特性:翻盖式;触点类型:下接;触点数量:6P;间距:0.5mm;安装类型:卧贴;工作温度范围:-25℃~+85℃;; LCSC Part Name: 间距:0.5mm P数:6P 翻盖式 下接; Supplier Part: C2856796; Manufacturer: XUNPU(讯普); Supplier Footprint: SMD,P=0.5mm,卧贴; JLCPCB Part Class: 扩展库; Datasheet: https://atta.szlcsc.com/upload/public/pdf/source/20210922/16B003FB53336DDF6538142CC465AC4D.pdf; Supplier: LCSC; Locking Feature: 翻盖式; Contact Type: 下接; Number of Contacts: 6P; Pitch: 0.5mm; Mounting Type: 卧贴; FFC, FCB Thickness: 0.3mm; Height Above Board: 2mm; Operating Temperature Range: -25℃~+85℃
L14 = BLM18AG601SN1D: 标称阻抗@测试频率:600Ω@100MHz;误差:±25%;直流电阻(RDC):380mΩ;; LCSC Part Name: 单路 0603磁珠 阻抗600Ω@100MHz; Supplier Part: C19330; Manufacturer: muRata(村田); Supplier Footprint: 0603; JLCPCB Part Class: 扩展库; Datasheet: https://atta.szlcsc.com/upload/public/pdf/source/20180329/C160981_FD3C2D2622A377E203B89F4AA32B0741.pdf; Supplier: LCSC; Impedance @ Frequency: 600Ω@100MHz; Tolerance: ±25%; DC Resistance: 380mΩ; Current Rating: 500mA; Circuits: 1
L15 = SWPA252012S220MT: 电感值:22uH;精度:±20%;额定电流:380mA;饱和电流(Isat):530mA;类型:-;; LCSC Part Name: 22uH ±20% 530mA; Supplier Part: C65856; Manufacturer: Sunlord(顺络); Supplier Footprint: 1008; JLCPCB Part Class: 扩展库; Datasheet: https://atta.szlcsc.com/upload/public/pdf/source/20231024/317626D2AA2F8AB4113C1875E432E6E1.pdf; Supplier: LCSC; Tolerance: ±20%; Rated Current: 380mA; Saturation Current (Isat): 530mA; DC Resistance (DCR): 1.52Ω
U13 = MT9284-28J: Supplier Part: C181780; Manufacturer: 西安航天民芯; Supplier Footprint: SOT-23-6; JLCPCB Part Class: 扩展库; Datasheet: https://atta.szlcsc.com/upload/public/pdf/source/20180228/C181780_15198093830931379337.pdf; Supplier: LCSC
X1 = X322524MOB4SI: 晶振类型:贴片晶振;频率:24MHz;常温频差:±10ppm;外接负载电容:12pF;频率稳定度(全温):±20ppm;; LCSC Part Name: 24MHz ±10ppm 12pF; Supplier Part: C70590; Manufacturer: YXC(扬兴晶振); Supplier Footprint: SMD3225-4P; JLCPCB Part Class: 扩展库; Datasheet: https://atta.szlcsc.com/upload/public/pdf/source/20240329/19D5F850207469550BEB00D7DFEDBC7A.pdf; Supplier: LCSC; Crystal Type: 贴片晶振; Normal temperature Frequency Tolerance: ±10ppm; External load capacitor: 12pF; Frequency Stability(Full temperature range): ±20ppm; Operating Temperature: -40℃~+85℃
X2 = X321532768KGD2SI: 晶振类型:贴片晶振;频率:32.768kHz;常温频差:±20ppm;外接负载电容:12.5pF;频率稳定度(全温):-;; LCSC Part Name: 32.768kHz ±20ppm 12.5pF; Supplier Part: C620155; Manufacturer: YXC(扬兴晶振); Supplier Footprint: SMD3215-2P; JLCPCB Part Class: 扩展库; Datasheet: https://atta.szlcsc.com/upload/public/pdf/source/20240329/3A7650FD985DD0DE85694D3785AB4916.pdf; Supplier: LCSC; Crystal Type: 贴片晶振; Normal temperature Frequency Tolerance: ±20ppm; External load capacitor: 12.5pF; Operating Temperature: -40℃~+85℃
D1 = BAT54C_C2135: 二极管配置:-;正向压降(Vf):1V@100mA;直流反向耐压(Vr):30V;平均整流电流(Io):200mA;; LCSC Part Name: 电压:30V 电流:200mA; Supplier Part: C2135; Manufacturer: CJ(江苏长电/长晶); Supplier Footprint: SOT-23; JLCPCB Part Class: 扩展库; Datasheet: https://atta.szlcsc.com/upload/public/pdf/source/20140809/1457707206468.pdf; Supplier: LCSC; Forward Voltage (Vf@If): 1V@100mA; Reverse Voltage (Vr): 30V; Average Rectified Current (Io): 200mA
L1 L3-L5 = WPN252010U2R2MT: 电感值:2.2uH;精度:±20%;额定电流:2.05A;饱和电流(Isat):2.6A;类型:-;; LCSC Part Name: 2.2uH ±20% 2.6A; Supplier Part: C279871; Manufacturer: Sunlord(顺络); Supplier Footprint: 1008; JLCPCB Part Class: 扩展库; Datasheet: https://atta.szlcsc.com/upload/public/pdf/source/20231024/AA72387348CB63159A6CBE41DDE5ECDA.pdf; Supplier: LCSC; Tolerance: ±20%; Rated Current: 2.05A; Saturation Current (Isat): 2.6A; DC Resistance (DCR): 80mΩ
LED1 = LED_0603-R: Supplier Footprint: 0603
U2-U5 = MT3520B: Supplier: LCSC; Supplier Part: C2684933; Manufacturer: 西安航天民芯; JLCPCB Part Class: 扩展库; Supplier Footprint: SOT-23-5; Datasheet: https://atta.szlcsc.com/upload/public/pdf/source/20210114/C2684933_96E48358A8EFBD651AA46655486A36EF.pdf
U1 = RV1106: Rockchip RV1106
LED2 LED4 LED5 = LED_0603-G: Supplier Footprint: 0603
CARD1 = TF-01A_C2889258: 卡类型:MicroSD卡(TF卡);连接器类型:卡座;卡连接方式:自弹式;本体最大高度:2mm;工作温度范围:-;; LCSC Part Name: TF卡座自弹式9P外焊卡座; Supplier Part: C2889258; Manufacturer: Yuandi(元迪); Supplier Footprint: SMD; JLCPCB Part Class: 扩展库; Datasheet: https://atta.szlcsc.com/upload/public/pdf/source/20210830/44259D2B93BF4B637A446EF1520C4989.pdf; Supplier: LCSC; Card Type: MicroSD卡(TF卡); Connector Type: 卡座; Card Connection Mode: 自弹式; Maximum Body Height: 2mm
D6 = SS34_C727060: 二极管配置:独立式;正向压降(Vf):550mV@3A;直流反向耐压(Vr):40V;平均整流电流(Io):3A;; LCSC Part Name: 电压:40V 电流:3A; Supplier Part: C727060; Manufacturer: TWGMC(台湾迪嘉); Supplier Footprint: SMA(DO-214AC); JLCPCB Part Class: 扩展库; Datasheet: https://atta.szlcsc.com/upload/public/pdf/source/20200828/C727059_6599B6CAC5F3238B9C33E46794659DBE.pdf; Supplier: LCSC; Diode Configuration: 独立式; Forward Voltage (Vf@If): 550mV@3A; Reverse Voltage (Vr): 40V; Average Rectified Current (Io): 3A; Reverse Leakage Current (Ir): 500uA@40V
H3 = HDR-M_2.54_1x6P: Supplier Part: C37208; Supplier Footprint: 插件
H4 = HDR-M_2.54_2x3: Supplier Part: C402781; Supplier Footprint: 插件,P=2.54mm
LED3 = LED_0603-B: Supplier Footprint: 0603
U10 = CH340E: 应用功能:收发器;接口协议:USB 2.0;数据速率:2Mbps;; LCSC Part Name: USB转串口芯片 CH340; Supplier Part: C99652; Manufacturer: WCH(南京沁恒); Supplier Footprint: MSOP-10; JLCPCB Part Class: 扩展库; Datasheet: https://atta.szlcsc.com/upload/public/pdf/source/20230530/6E401E9554E9F5311886CC8B3F89B62E.pdf; Supplier: LCSC; Applications Function: 收发器; Protocol: USB 2.0; Supply Voltage: 3.3V；5V; Data Rate: 2Mbps
USB2 = HC-TYPE-C-16P-01A: 连接器类型:Type-C;标准:-;公母:母;安装方式:卧贴;触点数量:16P;端口数量:1;额定电流 - 电源:5A;触头材质:铜;触头镀层:金;工作温度范围:-55℃~+85℃;焊接温度(最大值):260℃;; LCSC Part Name: Type-C 母 卧贴; Supplier Part: C2894897; Manufacturer: HCTL(华灿天禄); Supplier Footprint: SMD; JLCPCB Part Class: 扩展库; Datasheet: https://atta.szlcsc.com/upload/public/pdf/source/20221116/CF1C0058359F0761D6F7BB69303000BD.pdf; Supplier: LCSC; Connector Type: Type-C; Gender: 母; Mounting Style: 卧贴; Number of Contacts: 16P; Number of Ports: 1; Current Rating - Power (Max): 5A; Contact Material: 铜; Contact Plating: 金; Operating Temperature Range: -55℃~+85℃; Soldering Temperature(Max): 260℃
USB3 = USB-231-ARY: 连接器类型:Type-A;协议标准:USB 2.0;公母:母;安装方式:弯插;触点数量:4P;端口数量:1;额定电流 - 电源:1.5A;工作温度:-20℃~+70℃;; LCSC Part Name: Type-A 母 弯插; Supplier Part: C720525; Manufacturer: XUNPU(讯普); Supplier Footprint: 弯插; JLCPCB Part Class: Extended Part; Datasheet: https://item.szlcsc.com/datasheet/USB-231-ARY/763532.html; Supplier: LCSC; Connector Type: Type-A; Protocol Standard: USB 2.0; Gender: 母; Mounting Type: 弯插; Number of Contacts: 4P; Number of Ports: 1; Current Rating-Power: 1.5A; Voltage Rating: 30V; Length: 14.2mm; Detection color: 白色; Operating Temperature: -20℃~+70℃
L16 = AN2051-245: 小体积，高增益，WIFI，蓝牙，zigBee 2.4G天线; Supplier Part: C99727; Manufacturer: rainsun(霖昱微); Supplier Footprint: 2x5.1mm; JLCPCB Part Class: 扩展库; Datasheet: https://atta.szlcsc.com/upload/public/pdf/source/20170329/1490752053541.pdf; Supplier: LCSC
Q1 = 2SK3018_C8562: 类型:1个N沟道;漏源电压(Vdss):30V;连续漏极电流(Id):100mA;导通电阻(RDS(on)):13Ω@2.5V,1mA;耗散功率(Pd):350mW;阈值电压(Vgs(th)):800mV;; LCSC Part Name: 1个N沟道 耐压:30V 电流:100mA; Supplier Part: C8562; Manufacturer: CJ(江苏长电/长晶); Supplier Footprint: SOT-23; JLCPCB Part Class: 扩展库; Datasheet: https://atta.szlcsc.com/upload/public/pdf/source/20140809/1457707215233.pdf; Supplier: LCSC; Type: 1个N沟道; Drain to Source Voltage: 30V; Current - Continuous Drain(Id): 100mA; RDS(on): 13Ω@2.5V,1mA; Pd - Power Dissipation(Pd): 350mW; Gate Threshold Voltage (Vgs(th)@Id): 800mV; Input Capacitance(Ciss@Vds): 13pF; Reverse Transfer Capacitance (Crss@Vds): 4pF; Operating Temperature: -55℃~+150℃
U14 = RTL8723DS

## Nets
0V9: C1.2 C3.1 C4.2 C30.1 C31.1 C32.1 C33.1 C34.1 C35.1 C36.1 C37.1 C38.1 C39.1 C40.1 C41.1 C42.1 C43.1 C57.1 L1.2 R2.1 U1.10(DVDD_1) U1.51(DVDD_2) U1.54(DVDD_3) U1.55(DVDD_4) U1.67(PMU_DVDD0V9) U1.71(OSC_PLL_DVDD) U1.82(DVDD_5) U1.103(DVDD_6) U1.115(CPU_DVDD) U1.116(DVDD_7)
1V8: C14.2 C17.1 C18.2 C48.1 C49.1 C51.1 C54.1 L2.1 L5.2 L7.2 L9.2 Q1.1(G) R4.1 R7.1 R13.2 R42.1 R65.2 R66.2 R71.1 U1.53(DDR_PLL_AVDD1V8) U1.70(OSC_AVDD1V8/PLL_AVDD_1V8)
1V35: C6.2 C8.1 C9.2 C44.1 C45.1 C46.1 C47.1 L3.2 R6.1 U1.49(DDR_VDDQ_1) U1.50(DDR_VDDQ_2) U1.56(DDR_VDDQ_3)
3V3: C11.2 C13.1 C15.2 C26.1 C27.1 C29.1 C58.1 C59.1 C61.1 C62.1 C63.1 C78.1 C79.1 C91.1 C92.1 C93.1 C100.1 C101.1 C102.1 C107.1 C108.1 D1.1(A1) FPC1.4 FPC2.5 FPC3.1 FPC3.2 H1.1 H4.3 L4.2 L6.1 L8.2 L13.1 L17.1 R10.2 R11.2 R34.1 R45.1 R46.1 R64.1 R70.1 R72.1 R73.1 R74.1 U1.13(GPIO4_VCC) U1.28(USB_AVDD3V3) U1.61(PMU_VCC3V3) U1.81(GPIO1_VCC3V3) U1.88(GPIO6_VCC) U1.108(GPIO5_VCC) U10.7(VCC) U10.10(V3) U12.E6(VCC1) U12.F5(VCC2) U12.J10(VCC3) U12.K9(VCC4) U14.22(VDDIO)
3V3_A: C71.2 C111.1 L10.2 R31.2 U8.6(VDD)
+5V: C2.1 C7.1 C12.1 C16.1 C80.1 C81.1 C82.1 C96.1 C97.1 D6.1(C) H4.1 L15.1 R1.1 R5.1 R9.2 R12.2 R47.2 R52.2 U2.4(VIN) U3.4(VIN) U4.4(VIN) U5.4(VIN) U13.6(VIN)
AGND: C25.1 C65.2 C67.2 C68.1 C69.1 C71.1 C73.1 C111.2 MIC1.2(GND) MIC1.3(GND) R18.1 R30.1 R32.1 U1.37(CODEC_AVSS) U8.7(GND)
AVDD3V3_ETH: L6.2 U1.101(ETH_AVDD3V3)
GND: C2.2 C3.2 C4.1 C7.2 C8.2 C9.1 C10.1 C12.2 C13.2 C15.1 C16.2 C17.2 C18.1 C19.1 C20.1 C23.2 C24.2 C26.2 C27.2 C28.2 C29.2 C30.2 C31.2 C32.2 C33.2 C34.2 C35.2 C36.2 C37.2 C38.2 C39.2 C40.2 C41.2 C42.2 C43.2 C44.2 C45.2 C46.2 C47.2 C48.2 C49.2 C50.2 C51.2 C52.2 C53.2 C54.2 C55.2 C56.2 C57.2 C58.2 C59.2 C60.2 C61.2 C62.2 C63.2 C64.2 C74.2 C75.2 C76.2 C77.2 C78.2 C79.2 C80.2 C81.2 C82.2 C83.2 C84.2 C85.2 C86.2 C87.2 C88.2 C89.2 C91.2 C92.2 C93.2 C94.2 C95.2 C96.2 C97.2 C98.2 C99.2 C100.2 C101.2 C102.2 C103.2 C104.2 C105.2 C106.2 C107.2 C108.2 C109.2 C110.1 C112.1 C113.2 CARD1.6(VSS) CARD1.10(GND) CARD1.11(GND) CARD1.12(GND) CARD1.13(GND) D2.1 D3.1 D4.1 D5.1 D7.1 D8.1 FPC1.3 FPC1.29 FPC1.36 FPC2.4 FPC3.3 FPC3.4 FPC3.6 FPC3.9 FPC3.12 FPC3.15 FPC3.18 FPC3.20 FPC3.21 FPC3.22 H3.6 H4.2 H4.4 J1.7(NC) J1.8(CHS GND) J1.10 J1.11 LED1.1(C) LED2.1(C) LED5.1(C) R3.2 R8.2 R14.1 R15.1 R18.2 R19.2 R20.2 R50.1 R51.1 R53.1 R59.1 R60.1 R61.1 R62.2 R63.2 R69.1 R75.2 SW1.3 SW1.4 SW2.3 SW2.4 SW3.3 SW3.4 U1.57(TVSS) U1.129(E-PAD) U2.2(GND) U3.2(GND) U4.2(GND) U5.2(GND) U6.1 U6.3 U6.4 U7.3 U7.4 U9.3 U9.4 U10.3(GND) U11.4(GND) U11.9(EP) U12.A6(VSS2) U12.C4(VSS3) U12.E7(VSS4) U12.G5(VSS5) U12.H10(VSS6) U12.J5(VSS1) U12.K8(VSSQ1) U12.N2(VSSQ2) U12.N5(VSSQ3) U12.P4(VSSQ4) U12.P6(VSSQ5) U13.2(GND) U14.1(GND) U14.3(GND) U14.20(GND) U14.31(GND) U14.33(GND) U14.36(GND) USB2.1(SHELL) USB2.2(SHELL) USB2.3(SHELL) USB2.4(SHELL) USB2.A1B12(GND) USB2.B1A12(GND) USB3.4(GND) USB3.5(GND) USB3.6(GND) X1.2(GND) X1.4(GND)
VBAT: D1.2(A2) R16.1
VCC1V8_CODEC: C23.1 C24.1 L2.2 U1.31(CODEC_AVDD1V8)
VCC1V8_IO7: C64.1 R7.2 U1.1(MIPI_AVDD1V8/GPIO7_VCC1V8)
VCC1V8_MICBIAS: R28.1 U1.32(CODEC_MICBIAS)
VCC1V8_USB: C28.1 R4.2 U1.24(SARADC_USB_AVDD1V8)
VCC3V3_RTC: C56.1 R17.1 U1.19(RTC_AVDD3V3)
VCC_FLASH: C60.1 C84.1 C85.1 C86.1 C87.1 C88.1 C89.1 L8.1 L9.1 R54.1 R55.1 R56.2 R57.2 R58.2 U1.43(GPIO3_VCC) U11.8(VCC) U12.C6(VCCQ1) U12.M4(VCCQ2) U12.N4(VCCQ3) U12.P3(VCCQ4) U12.P5(VCCQ5)
ADCIN0: C77.1 D3.2 R42.2 R43.1 R44.1 U1.23(SARADC_IN0/GPI4_C0_z)
ADCIN1: U1.22(SARADC_IN1/PWM1_M1/GPI4_C1_z)
EMMC_CLK/FSPI_CLK: R23.2 U11.6(CLK) U12.M6(CLK)
EMMC_CMD/FSPI_CS: R58.1 U1.47(EMMC_CMD/FSPI_CS0/GPIO4_B0_u) U11.1(CS#) U12.M5(CMD)
EMMC_D0/FSPI_D0: R57.1 U1.41(EMMC_D0/FSPI_D0/GPIO4_A4_u) U11.5(DI(IO0)) U12.A3(DATA0)
EMMC_D1/FSPI_D1: U1.42(EMMC_D1/FSPI_D1/GPIO4_A3_u) U11.2(DO(IO1)) U12.A4(DATA1)
EMMC_D2/FSPI_D2: R54.2 U1.44(EMMC_D2/FSPI_D2/GPIO4_A2_u) U11.3(WP#(IO2)) U12.A5(DATA2)
EMMC_D3/FSPI_D3: R55.2 U1.39(EMMC_D3/FSPI_D3/GPIO4_A6_u) U11.7(HOLD#(IO3)) U12.B2(DATA3)
EMMC_D4: U1.40(EMMC_D4/SPI1_CS0_M0/UART1_TX_M2/I2C2_SDA_M1/GPIO4_A5_u) U12.B3(DATA4)
EMMC_D5: U1.38(EMMC_D5/SPI1_CLK_M0/UART1_RX_M2/I2C2_SCL_M1/GPIO4_A7_u) U12.B4(DATA5)
EMMC_D6: U1.45(EMMC_D6/SPI1_MOSI_M0/UART0_TX_M2/I2C0_SCL_M1/GPIO4_A1_u) U12.B5(DATA6)
EMMC_D7: U1.46(EMMC_D7/SPI1_MISO_M0/UART0_RX_M2/I2C0_SDA_M1/GPIO4_A0_u) U12.B6(DATA7)
ETH_RN: R36.2 U1.97(ETH_PHY_RXN)
ETH_RP: R37.2 U1.98(ETH_PHY_RXP)
ETH_TN: R38.2 U1.99(ETH_PHY_TXN)
ETH_TP: R39.2 U1.100(ETH_PHY_TXP)
G0A0: U1.58(UART0_RX_M0/CLK_32K/CLK_REFOUT/RTC_CLKO/GPIO0_A0_z)
G0A1: U1.59(UART0_TX_M0/PWM2_M0/GPIO0_A1_d)
G0A2: U1.60(PWM3_IR_M0/GPIO0_A2_d)
G0A3_TP_INT: FPC2.3 U1.62(PMIC_PWR_CTRL_M1/GPIO0_A3_u)
G0A4_TP_RESET: FPC2.6 U1.63(PMIC_PWR_CTRL_M0/PWM1_M0/GPIO0_A4_d)
G0A5_I2C1_SCL: FPC2.1 R74.2 U1.64(I2C1_SCL_M0/UART1_RTS_M0/PWM5_M0/GPIO0_A5_d)
G0A6_I2C1_SDA: FPC2.2 R73.2 U1.65(I2C1_SDA_M0/UART1_CTS_M0/PWM6_M0/GPIO0_A6_d)
G1A0: U1.72(UART3_TX_M0/I2C2_SCL_M0/PWM7_IR_M0/GPIO1_A0_d)
G1A1_PWM4: R62.1 U1.73(UART3_RX_M0/I2C2_SDA_M0/PWM4_M0/GPIO1_A1_d) U13.4(EN)
G1A2_WL_EN: R68.1 U1.74(PWM0_M0/CPU_AVS/VI_CIF_D0_M1/GPIO1_A2_d) U14.12(WL_REG_ON)
G1A3_TX1: U1.75(UART1_TX_M0/I2C0_SCL_M0/GPIO1_A3_d) U14.43(UART_RXD)
G1A4_RX1: U1.76(UART1_RX_M0/I2C0_SDA_M0/GPIO1_A4_d) U14.42(UART_TXD)
G1B0_ETH_ACT: R40.2 U1.77(UART4_RX_M0/PWM3_IR_M1/GPIO1_B0_d)
G1B1_ETH_SPD: R41.2 U1.78(UART4_TX_M0/PWM7_IR_M1/SPI1_CS1_M0/VI_CIF_D1_M1/GPIO1_B1_d)
G1B2_TX2: H4.6 LED3.1(C) U1.79(JTAG_CPU_TCK_M1/UART2_TX_M1/JTAG_HPMCU_TCK_M0/JTAG_LPMCU_TCK_M0/GPIO1_B2_d) U10.9(RXD)
G1B3_RX2: H4.5 LED4.1(C) U1.80(JTAG_CPU_TMS_M1/UART2_RX_M1/JTAG_HPMCU_TMS_M0/JTAG_LPMCU_TMS_M0/GPIO1_B3_u) U10.8(TXD)
G3B0: H3.1 U1.117(VI_CIF_D0_M0/MIPI_CSI_RX_D3N/LVDS_RX_D3N/GPIO3_B0_d)
G3B1: H3.2 U1.118(VI_CIF_D1_M0/MIPI_CSI_RX_D3P/LVDS_RX_D3P/GPIO3_B1_d)
G3B2: H3.3 U1.119(VI_CIF_D2_M0/MIPI_CSI_RX_CK1N/LVDS_RX_CK1N/GPIO3_B2_d)
G3B3: H3.4 U1.120(VI_CIF_D3_M0/MIPI_CSI_RX_CK1P/LVDS_RX_CK1P/GPIO3_B3_d)
G3B4: H3.5 U1.121(VI_CIF_D4_M0/MIPI_CSI_RX_D2N/LVDS_RX_D2N/GPIO3_B4_d)
G3B5: U1.122(VI_CIF_D5_M0/MIPI_CSI_RX_D2P/LVDS_RX_D2P/GPIO3_B5_d)
G3C6_WL_WAKE_HOST: Q1.2(S) R71.2 U1.4(VI_CIF_D10/PWM7_IR_M2/MIPI_CLK1_OUT/GPIO3_C6_d)
G3C7: U1.5(VI_CIF_D11/UART5_TX_M2/I2C4_SCL_M2/GPIO3_C7_d)
G3D0: U1.7(VI_CIF_D12/UART5_RX_M2/I2C4_SDA_M2/GPIO3_D0_d)
G3D3: R27.1 U1.9(VI_CIF_D15/PWM1_M2/GPIO3_D3_d)
LINE_OUT: C70.1 U1.29(CODEC_LINEOUT)
MIC0_N: C22.1 C66.2 R30.2 U7.2
MIC0_P: C21.1 C66.1 MIC1.1(OUT) R29.1 U7.1
MIPI_I2C3_SCL: FPC3.8 R65.1 U1.6(VI_CIF_D13/UART5_RTS_M2/I2C3_SCL_M2/GPIO3_D1_d)
MIPI_I2C3_SDA: FPC3.7 R66.1 U1.8(VI_CIF_D14/UART5_CTS_M2/I2C3_SDA_M2/GPIO3_D2_d)
MIPI_MCLK0: FPC3.19 R26.2
MIPI_RST: FPC3.5 U1.3(VI_CIF_VSYNC_M0/GPIO3_C5_d)
MIPI_RX_CLK0N: FPC3.13 U1.125(VI_CIF_D8_M0/MIPI_CSI_RX_CK0N/LVDS_RX_CK0N/GPIO3_C0_d)
MIPI_RX_CLK0P: FPC3.14 U1.126(VI_CIF_D9_M0/MIPI_CSI_RX_CK0P/LVDS_RX_CK0P/GPIO3_C1_d)
MIPI_RX_D0N: FPC3.16 U1.127(VI_CIF_CLKI_M0/MIPI_CSI_RX_D0N/LVDS_RX_D0N/GPIO3_C2_d)
MIPI_RX_D0P: FPC3.17 U1.128(VI_CIF_HREF_M0/MIPI_CSI_RX_D0P/LVDS_RX_D0P/GPIO3_C3_d)
MIPI_RX_D1N: FPC3.10 U1.123(VI_CIF_D6_M0/MIPI_CSI_RX_D1N/LVDS_RX_D1N/GPIO3_B6_d)
MIPI_RX_D1P: FPC3.11 U1.124(VI_CIF_D7_M0/MIPI_CSI_RX_D1P/LVDS_RX_D1P/GPIO3_B7_d)
MMC_CLK: CARD1.5(CLK) R25.2 U14.17(SDIO_DATA_CLK)
MMC_CMD: CARD1.3(CMD) U1.16(SDMMC0_CMD/UART5_CTS_M0/I2C0_SDA_M2/JTAG_LPMCU_TMS_M1/PWM11_IR_M0/GPIO3_A5_u) U14.16(SDIO_DATA_CMD)
MMC_D0: CARD1.7(DAT0) U1.14(SDMMC0_D0/UART2_RX_M0/PWM8_M0/GPIO3_A3_u) U14.18(SDIO_DATA_0)
MMC_D1: CARD1.8(DAT1) U1.12(SDMMC0_D1/UART2_TX_M0/PWM9_M0/GPIO3_A2_u) U14.19(SDIO_DATA_1)
MMC_D2: CARD1.1(DAT2) U1.18(SDMMC0_D2/UART5_RX_M0/JTAG_CPU_TCK_M0/JTAG_HPMCU_TCK_M1/GPIO3_A7_u) U14.14(SDIO_DATA_2)
MMC_D3: CARD1.2(CD/DAT3) U1.17(SDMMC0_D3/UART5_TX_M0/JTAG_CPU_TMS_M0/JTAG_HPMCU_TMS_M1/GPIO3_A6_u) U14.15(SDIO_DATA_3)
MMC_DET: CARD1.9(CD) R24.2
NPOR: C75.1 D2.2 R34.2 R35.1 U1.66(nPOR)
RGB_CLK: FPC1.30 U1.85(VO_LCDC_CLK/VI_CIF_CLKO_M1/I2C3_SCL_M1/UART5_TX_M1/PWM11_IR_M2/AUD_DSM_N/GPIO1_D3_d)
RGB_D0: FPC1.23 U1.84(VO_LCDC_D0/VI_CIF_D9_M1/PWM11_IR_M1/UART4_CTS_M1/GPIO1_C7_d)
RGB_D1: FPC1.24 U1.83(VO_LCDC_D1/VI_CIF_D8_M1/PWM10_M1/UART4_RTS_M1/GPIO1_C6_d)
RGB_D2: FPC1.25 U1.90(VO_LCDC_D2/VI_CIF_D7_M1/PWM9_M1/UART4_TX_M1/SDMMC1_D2_M1/GPIO1_C5_d)
RGB_D3: FPC1.26 U1.91(VO_LCDC_D3/VI_CIF_D6_M1/PWM8_M1/UART4_RX_M1/SDMMC1_D3_M1/GPIO1_C4_d)
RGB_D4: FPC1.27 U1.92(VO_LCDC_D4/VI_CIF_D5_M1/PWM6_M2/I2C4_SDA_M1/SDMMC1_CMD_M1/SPI0_MISO_M0/GPIO1_C3_d)
RGB_D5: FPC1.28 U1.93(VO_LCDC_D5/VI_CIF_D4_M1/PWM5_M2/I2C4_SCL_M1/SDMMC1_CLK_M1/SPI0_MOSI_M0/GPIO1_C2_d)
RGB_D6: FPC1.15 U1.94(VO_LCDC_D6/VI_CIF_D3_M1/PWM4_M2/SPI0_CLK_M0/SDMMC1_D0_M1/GPIO1_C1_d)
RGB_D7: FPC1.16 U1.95(VO_LCDC_D7/VI_CIF_D2_M1/PWM2_M2/SPI0_CS0_M0/SDMMC1_D1_M1/GPIO1_C0_d)
RGB_D8: FPC1.17 U1.109(SDMMC1_D1_M0/I2S0_SCLK/VO_LCDC_D8/UART1_CTS_M1/I2C4_SDA_M0/GPIO2_A0_d)
RGB_D9: FPC1.18 U1.110(SDMMC1_D0_M0/I2S0_LRCK/VO_LCDC_D9/UART1_RTS_M1/I2C4_SCL_M0/GPIO2_A1_d)
RGB_D10: FPC1.19 U1.111(SDMMC1_CLK_M0/I2S0_MCLK/VO_LCDC_D10/GPIO2_A2_d)
RGB_D11: FPC1.20 U1.112(SDMMC1_CMD_M0/I2S0_SDO3_SDI1/VO_LCDC_D11/GPIO2_A3_d)
RGB_D12: FPC1.7 U1.113(SDMMC1_D3_M0/I2S0_SDO0/VO_LCDC_D12/UART1_TX_M1/GPIO2_A4_d)
RGB_D13: FPC1.8 U1.114(SDMMC1_D2_M0/I2S0_SDI0/VO_LCDC_D13/UART1_RX_M1/GPIO2_A5_d)
RGB_D14: FPC1.9 U1.107(UART0_RTS_M1/I2S0_SDO2_SDI2/VO_LCDC_D14/PWM2_M1/I2C3_SCL_M0/FLASH_TRIG_OUT/GPIO2_A6_d)
RGB_D15: FPC1.10 U1.106(UART0_CTS_M1/I2S0_SDO1_SDI3/VO_LCDC_D15/PWM4_M1/I2C3_SDA_M0/PRELIGHT_TRIG_OUT/GPIO2_A7_d)
RGB_D16: FPC1.11 U1.105(UART0_RX_M1/I2C1_SDL_M1/VO_LCDC_D16/PWM5_M1/GPIO2_B0_d)
RGB_D17: FPC1.12 U1.104(UART0_TX_M1/I2C1_SDA_M1/VO_LCDC_D17/PWM6_M1/GPIO2_B1_d)
RGB_DE: FPC1.34 U1.89(VO_LCDC_DEN/VI_CIF_CLKI_M1/PWM3_IR_M2/UART5_RTS_M1/UART3_TX_M1/GPIO1_D0_d)
RGB_HSYNC: FPC1.32 U1.87(VO_LCDC_HSYNC/VI_CIF_HREF_M1/PWM10_M2/UART5_CTS_M1/UART3_RX_M1/GPIO1_D1_d)
RGB_VSYNC: FPC1.33 U1.86(VO_LCDC_VSYNC/VI_CIF_VSYNC_M1/I2C3_SDA_M1/UART5_RX_M1/SPI0_CS1_M0/PWM0_M1/AUD_DSM_P/GPIO1_D2_d)
SPK_OUTN: L12.1 U8.5(VON)
SPK_OUTP: L11.1 U8.8(VOP)
TFT_LED+: FPC1.2 L14.2
TFT_LED-: FPC1.1 R63.1 U13.3(FB)
UART_DN: D4.2 U10.2(UD-) USB3.2(D-)
UART_DP: D5.2 U10.1(UD+) USB3.3(D+)
USB_CC1: R51.2 USB2.A5(CC1)
USB_CC2: R53.2 USB2.B5(CC2)
USB_DET: C83.1 R47.1 R50.2 U1.25(USB_VBUSDET)
USB_DN: R48.2 U1.26(USB_DN)
USB_DP: R49.1 U1.27(USB_DP)
WL_WAKE_HOST: Q1.3(D) R72.2 U14.13(WL_HOST_WAKE)
$1N1: C20.2 R12.1 U5.1(EN)
$1N4: C14.1 R13.1 R15.2 U5.5(FB)
$1N5: L5.1 U5.3(SW)
$1N13: D1.3(K) R17.2
$1N16: R16.2 U6.2
$1N36: C19.2 R9.1 U4.1(EN)
$1N38: C11.1 R10.1 R14.2 U4.5(FB)
$1N39: L4.1 U4.3(SW)
$1N40: C10.2 R5.2 U3.1(EN)
$1N43: C6.1 R6.2 R8.1 U3.5(FB)
$1N44: L3.1 U3.3(SW)
$1N46: LED1.2(A) R11.1
$1N49: C112.2 R1.2 U2.1(EN)
$1N52: C1.1 R2.2 R3.1 U2.5(FB)
$1N53: L1.1 U2.3(SW)
$2N14: R20.1 U1.102(ETH_EXTR)
$2N28: C25.2 U1.30(CODEC_VCM)
$2N32: C22.2 U1.33(CODEC_MIC0N)
$2N33: C21.2 U1.34(CODEC_MIC0P)
$2N36: R19.1 U1.52(DRAM_ZQ)
$3N29: C55.1 U1.21(OSC_RTC_XIN) X2.1
$3N30: C53.1 U1.20(OSC_RTC_XOUT) X2.2
$3N31: C50.1 R21.1 X1.3(OSC2)
$3N32: R21.2 R22.1 U1.69(OSC_SOC_XOUT)
$3N34: C52.1 R22.2 U1.68(OSC_SOC_XIN) X1.1(OSC1)
$3N41: L7.1 U1.96(OTP_AVDD1V8/ETH_AVDD1V8/TSADC_AVDD1V8)
$4N9: R25.1 U1.15(SDMMC0_CLK/UART5_RTS_M0/I2C0_SCL_M2/JTAG_LPMCU_TCK_M1/PWM10_M0/GPIO3_A4_d)
$4N14: R24.1 U1.11(SDMMC0_DET/GPIO3_A1_u)
$4N19: R23.1 U1.48(EMMC_CLK/FSPI_CLK/GPIO4_B1_d)
$5N1: LED2.2(A) R27.2
$5N12: R26.1 U1.2(VI_CIF_CLKO_M0/MIPI_CLK0_OUT/GPIO3_C4_d)
$6N3: H1.2 L10.1
$6N11: C73.2 L12.2 U9.2
$6N12: C68.2 L11.2 U9.1
$6N18: C70.2 R33.2
$6N19: R33.1 U8.4(INN)
$6N20: C69.2 U8.2(BYPASS)
$6N23: C67.1 R31.1 R32.2 U8.1(CTRL)
$6N28: C65.1 MIC1.4(VDD) R28.2 R29.2
$7N5: J1.9 R40.1
$7N6: J1.12 R41.1
$7N11: C76.1 J1.4
$7N13: C74.1 J1.5
$7N18: J1.1(TD+) R39.1
$7N19: J1.2(TD-) R38.1
$7N21: J1.6(RD-) R36.1
$7N22: R43.2 SW3.1 SW3.2
$7N23: R44.2 SW2.1 SW2.2
$7N24: R35.2 SW1.1 SW1.2
$7N32: J1.3(RD+) R37.1
$7N34: C113.1 J1.SH1 J1.SH2 R75.1
$8N5: D6.2(A) USB2.A4B9(VBUS) USB2.B4A9(VBUS)
$8N27: LED5.2(A) R52.1
$8N37: D7.2 R49.2 USB2.A6(D+) USB2.B6(D+)
$8N38: D8.2 R48.1 USB2.A7(D-) USB2.B7(D-)
$8N51: LED4.2(A) R46.2
$8N52: LED3.2(A) R45.2
$9N21: C110.2 U12.C2(VDDi)
$9N23: R56.1 U12.K5(RST_n)
$10N1: C94.1 C95.1 CARD1.4(VDD) L13.2
$11N1: FPC1.21 FPC1.22 R61.2
$11N2: FPC1.13 FPC1.14 R60.2
$11N3: FPC1.5 FPC1.6 R59.2
$11N32: C98.1 C99.1 D16.1(K) L14.1 U13.5(OV)
$11N38: FPC1.31 R64.2
$11N45: D16.2(A) L15.2 U13.1(SW)
$13N9: C109.1 U14.24(LPO)
$13N14: C105.1 C106.1 L17.2 R68.2 U14.9(VBAT)
$13N17: R69.2 U14.41(UART_RTS_N)
$13N19: R70.2 U14.34(BT_RST_N)
$13N22: C104.1 L16.1(ANT) R67.1
$13N30: C103.1 R67.2 U14.2(WL_BT_ANT)

Not connected (* = marked no-connect by the designer): FPC1 35* 37* 38* 39* 40* 41* 42*; FPC2 7* 8*; L16 2*; U1 35(CODEC_MIC1N)* 36(CODEC_MIC1P)*; U8 3(NC)*; U10 4(RTS#)* 5(CTS#)* 6(TNOW)*; U12 E9(VSF1)* E10(VSF2)* F10(VSF3)* H5(Data Strobe)* K10(VSF4)*; U14 4(FM_RX)* 5(N_WAKE)* 6(BT_WAKE)* 7(BT_HOST_WAKE)* 8(BT_VIO/N_HOST_WAKE)* 10(XTAL_IN)* 11(XTAL_OUT)* 21(VIN_LDO_OUT)* 23(VIN_LDO)* 25(PCM_OUT)* 26(PCM_CLK)* 27(PCM_IN)* 28(PCM_SYNC)* 29(VDD_TCXO)* 30(TCXO_IN)* 32(GPS_RF)* 35(N_I2C_SDA)* 37(N_I2C_SCL)* 38(N_REG_PU)* 39(TX2)* 40(TX1)* 44(UART_CTS_N)*; USB2 A8(SBU1)* B8(SBU2)*; USB3 1(VBUS)*

## Notes on the sheets
sheet 1
- step1
- 电感建议选择一体成型的。
- 这个电容不接
- step2
- step3
- step2
- RTC供电
sheet 2
- 靠近芯片
sheet 4
- 二选一
sheet 6
- 话筒
- 两种话筒二选一。
  如使用内置话筒MIC1，
  不安装R28，R29更换为0欧姆。
- 话筒替代型号
  XHXDZ-2718。
- 焊接下拉电阻和电容
  为防失真模式
  不焊接为普通模式。
- 音频放大器
- Av = 360k/(10k+30k) = 9
  Fc = 1/(2*π*(10k+30k)*47nf)= 84hz
sheet 8
- 串口
- 接口
- 如需外接串口电路，只焊接排针，
  不用焊接全部串口电路即可。
- USB和电源
- USB检测电压2.8V~3.3V，
  检测为该区间为插入USB。
sheet 9
- PCB连线时先连接
  NAND FLASH
  再连接EMMC。
- EMMC和NAND FLASH二选一。
sheet 11
- RGB LCD
- 芯片PWM范围20KHZ~1MHZ。
- 耐压50V。
- I = 104mV / R = 104 / 5.1 = 20mA
- R70-R72测试用，不用安装。
- 电容触摸
